# EAGLE design SparkFun_Main_Board_Single_v21 (EAGLE 9.4.2)
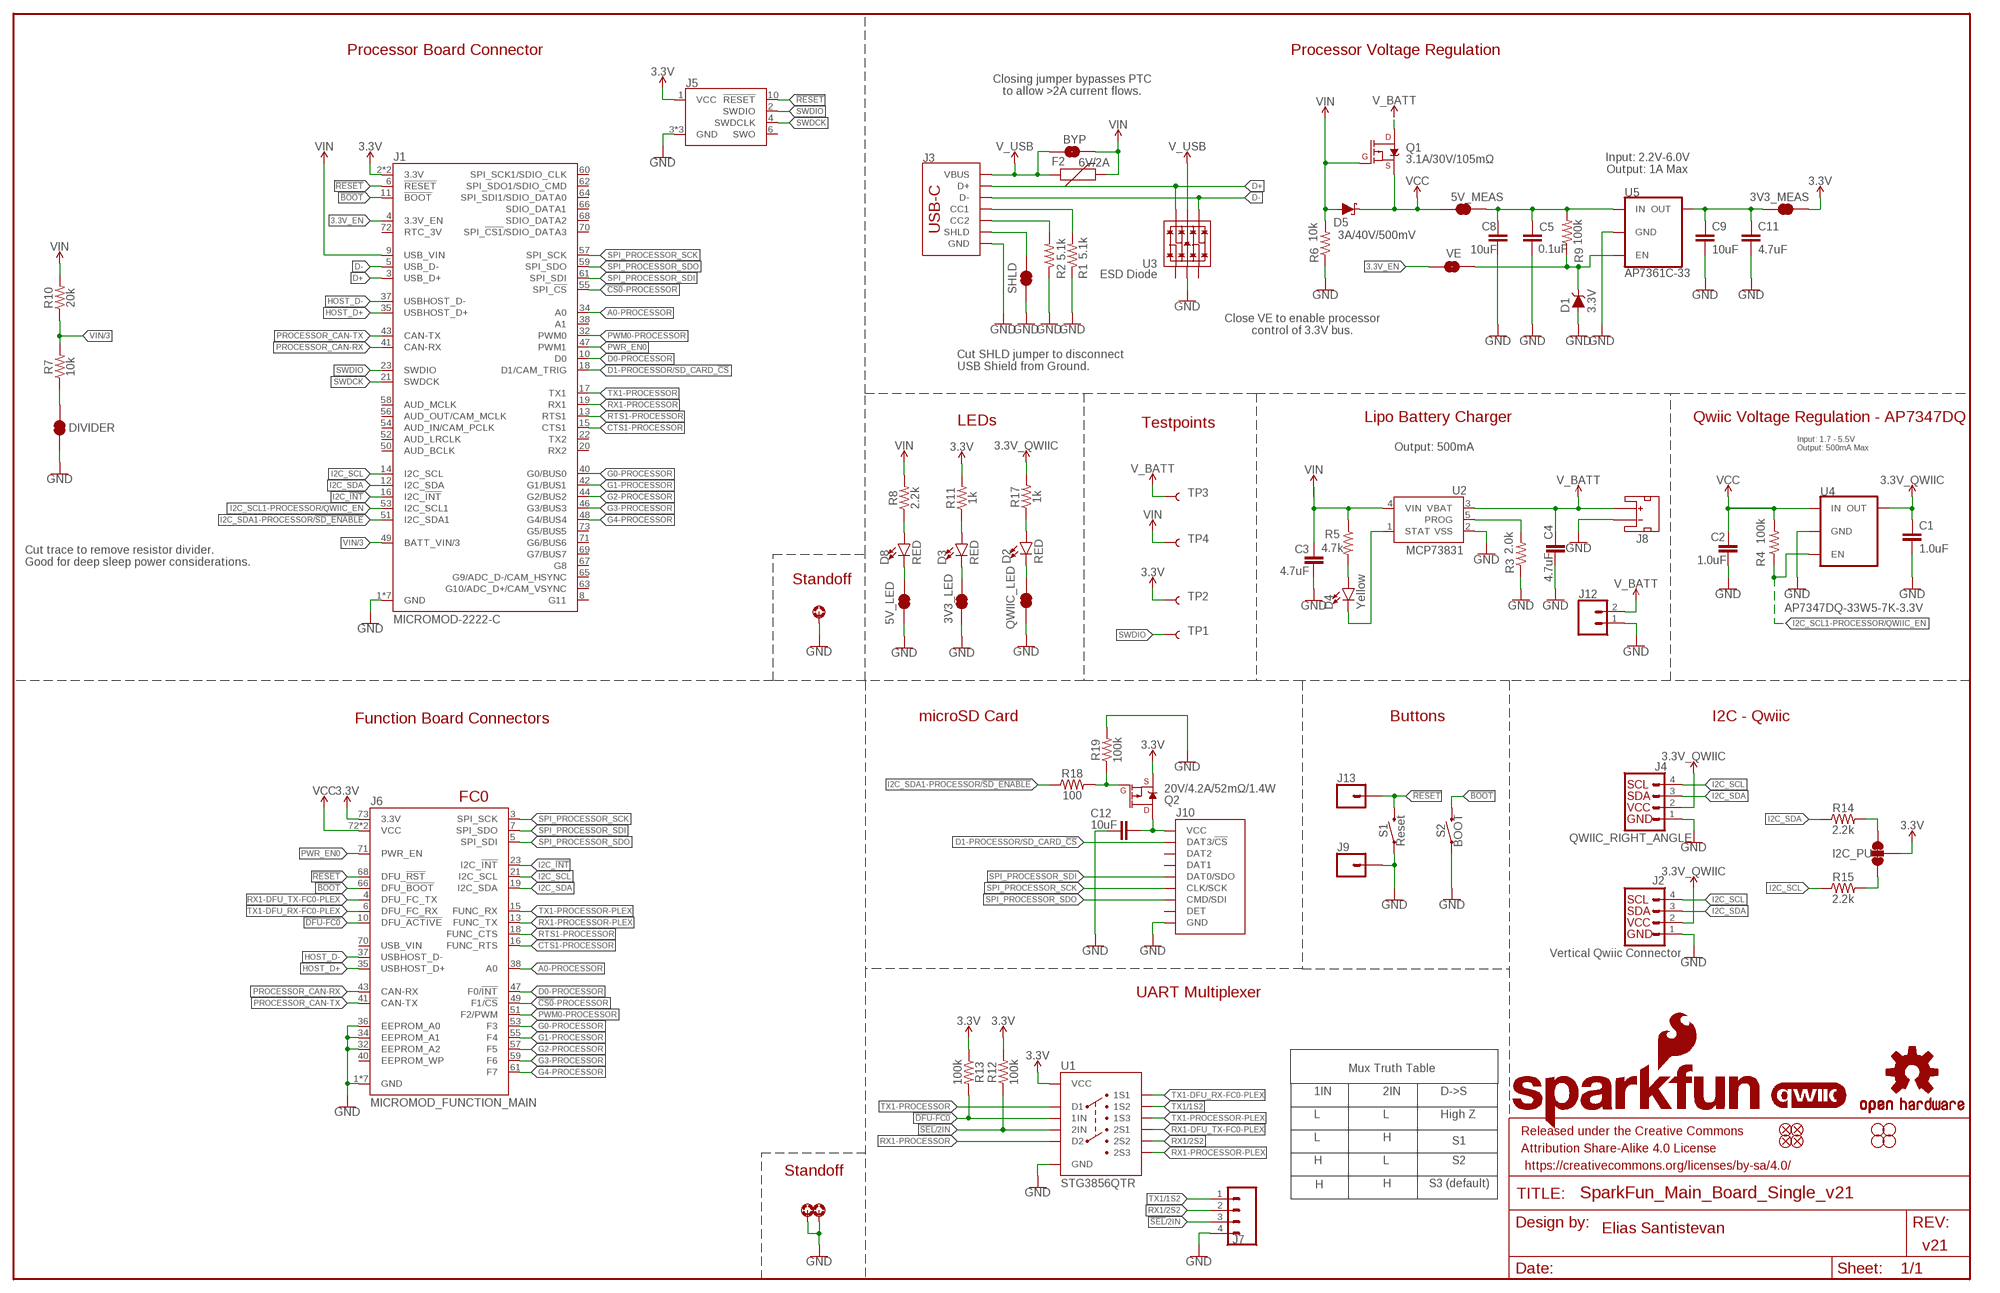
[diagram p0: schematic, sheet 1]

## Parts
3V3_LED  JUMPER-SMT_2_NC_TRACE_SILK  [SMT-JUMPER_2_NC_TRACE_SILK]
3V3_MEAS  JUMPER-COMBO_2_NC_TRACE  [COMBO-JUMPER_2_NC_TRACE]
5V_LED  JUMPER-SMT_2_NC_TRACE_SILK  [SMT-JUMPER_2_NC_TRACE_SILK]
5V_MEAS  JUMPER-COMBO_2_NC_TRACE  [COMBO-JUMPER_2_NC_TRACE]
BYP  JUMPER-SMT_2_NO_SILK  [SMT-JUMPER_2_NO_SILK]
C1  1.0uF  1.0UF-0603-16V-10%  [0603]
C2  1.0uF  1.0UF-0603-16V-10%  [0603]
C3  4.7uF  4.7UF-0603-6.3V-(10%)  [0603]
C4  4.7uF  4.7UF-0603-35V-(20%)  [0603]
C5  0.1uF  0.1UF-0603-25V-(+80/-20%)  [0603]
C8  10uF  10UF-0805-10V-10%  [0805]
C9  10uF  10UF-0603-6.3V-20%  [0603]
C11  4.7uF  4.7UF-0603-6.3V-(10%)  [0603]
C12  10uF  10UF-0603-6.3V-20%  [0603]
D1  3.3V  DIODE-ZENER-MM3Z3V3T1G  [SOD-323]
D2  RED  LED-RED0603  [LED-0603]
D3  RED  LED-RED0603  [LED-0603]
D4  Yellow  LED-YELLOW0603  [LED-0603]
D5  3A/40V/500mV  DIODE-SCHOTTKY-B340A  [SMA-DIODE]
D8  RED  LED-RED0603  [LED-0603]
DIVIDER  JUMPER-SMT_2_NC_TRACE_SILK  [SMT-JUMPER_2_NC_TRACE_SILK]
F2  6V/2A  PPTC_6V2A  [1210]
FD1  FIDUCIAL1X2  [FIDUCIAL-1X2]
FD2  FIDUCIAL1X2  [FIDUCIAL-1X2]
FD3  FIDUCIAL1X2  [FIDUCIAL-1X2]
FD4  FIDUCIAL1X2  [FIDUCIAL-1X2]
FRAME1  FRAME-LEDGER  [CREATIVE_COMMONS]
H2  STAND-OFF-REFLOW-M2.5_2.5MM_TALL  [STAND-OFF-REFLOW-M2.5]
H4  STAND-OFF-REFLOW-M2.5_2.5MM_TALL  [STAND-OFF-REFLOW-M2.5]
H8  STAND-OFF-REFLOW-M2.5_2.5MM_TALL  [STAND-OFF-REFLOW-M2.5]
H14  STAND-OFFTIGHT  [STAND-OFF-TIGHT]
H15  STAND-OFFTIGHT  [STAND-OFF-TIGHT]
H16  STAND-OFFTIGHT  [STAND-OFF-TIGHT]
H17  STAND-OFFTIGHT  [STAND-OFF-TIGHT]
I2C_PU  JUMPER-SMT_3_2-NC_TRACE_SILK  [SMT-JUMPER_3_2-NC_TRACE_SILK]
J1  MICROMOD-2222-C  [M.2-CONNECTOR-E]
J2  Vertical Qwiic Connector  QWIIC_CONNECTOR  [JST04_1MM_VERT]
J3  USB_C_2-LAYER_PADS  [USB-C-16P-2LAYER-PADS]
J4  QWIIC_RIGHT_ANGLE  QWIIC_CONNECTORJS-1MM  [JST04_1MM_RA]
J5  CORTEX_JTAG_DEBUG_MINIMUM_PTH  [2X5-PTH-1.27MM]
J6  MICROMOD_FUNCTION_MAIN  [M.2-CONNECTOR-E-FUNCTION-STANDARD]
J7  CONN_041X04_NO_SILK  [1X04_NO_SILK]
J8  JST_2MM_MALE  [JST-2-SMD]
J9  CONN_01PTH_NO_SILK_YES_STOP  [1X01_NO_SILK]
J10  MICRO-SD-PUSH-PUSH-EXT-PIN  [MICROSD-EXTERNALPIN]
J12  CONN_021X02_NO_SILK  [1X02_NO_SILK]
J13  CONN_01PTH_NO_SILK_YES_STOP  [1X01_NO_SILK]
LOGO1  QWIIC_LOGO_8MM  [QWIIC_8MM]
LOGO2  SFE_LOGO_NAME_FLAME.3_INCH  [SFE_LOGO_NAME_FLAME_.3]
LOGO3  OSHW-LOGOL  [OSHW-LOGO-L]
Q1  3.1A/30V/105mΩ  MOSFET_PCH-DMG2307L  [SOT23-3]
Q2  20V/4.2A/52mΩ/1.4W  MOSFET_PCH-DMG2305UX-7  [SOT23-3]
QWIIC_LED  JUMPER-SMT_2_NC_TRACE_SILK  [SMT-JUMPER_2_NC_TRACE_SILK]
R1  5.1k  5.1KOHM5.1KOHM-0603-1/10W-1%  [0603]
R2  5.1k  5.1KOHM5.1KOHM-0603-1/10W-1%  [0603]
R3  2.0k  2.0KOHM-0603-1/10W-5%  [0603]
R4  100k  100KOHM-0603-1/10W-1%  [0603]
R5  4.7k  4.7KOHM-0603-1/10W-1%  [0603]
R6  10k  10KOHM-0603-1/10W-1%  [0603]
R7  10k  10KOHM-0603-1/10W-1%  [0603]
R8  2.2k  2.2KOHM-0603-1/10W-1%  [0603]
R9  100k  100KOHM-0603-1/10W-1%  [0603]
R10  20k  20KOHM-0603-1/10W-1%  [0603]
R11  1k  1KOHM-0603-1/10W-1%  [0603]
R12  100k  100KOHM-0603-1/10W-1%  [0603]
R13  100k  100KOHM-0603-1/10W-1%  [0603]
R14  2.2k  2.2KOHM-0603-1/10W-1%  [0603]
R15  2.2k  2.2KOHM-0603-1/10W-1%  [0603]
R17  1k  1KOHM-0603-1/10W-1%  [0603]
R18  100  100OHM-0603-1/10W-1%  [0603]
R19  100k  100KOHM-0603-1/10W-1%  [0603]
S1  Reset  MOMENTARY-SWITCH-SPST-SMD-5.2-TALL-REDUNDANT  [TACTILE_SWITCH_SMD_5.2MM]
S2  BOOT  MOMENTARY-SWITCH-SPST-SMD-5.2-TALL-REDUNDANT  [TACTILE_SWITCH_SMD_5.2MM]
SHLD  JUMPER-SMT_2_NC_TRACE_SILK  [SMT-JUMPER_2_NC_TRACE_SILK]
TP1  TEST-POINT3X5  [PAD.03X.05]
TP2  TEST-POINT3X5  [PAD.03X.05]
TP3  TEST-POINT3X5  [PAD.03X.05]
TP4  TEST-POINT3X5  [PAD.03X.05]
U1  STG3856QTR  [STG3856]
U2  MCP73831  [SOT23-5]
U3  ESD Diode  TVS_DIODE_ARRAYSMD  [SOT-23-6]
U4  AP7347DQ-33W5-7K-3.3V  [SOT25]
U5  AP7361C-33  AP7361C-33FGEUDFN-8  [UDFN-8]
VE  JUMPER-SMT_2_NO_SILK  [SMT-JUMPER_2_NO_SILK]

## Nets
3.3V [POWER]: 3V3_MEAS.2 3V3_MEAS.4 I2C_PU.2 J1.2(3.3V) J1.74(3.3V) J5.1(VCC) J6.73(3.3V) Q2.2(S) R11.2 R12.2 R13.1 TP2.1 U1.P11(VCC)
3.3V_EN: J1.4(3.3V_EN) VE.1
3.3V_EN_VE: D1.C R9.1 U5.5(EN) VE.2
3.3V_QWIIC: C1.1 J2.2 J4.2 R17.2 U4.5(OUT)
3V3_MEAS: 3V3_MEAS.1 3V3_MEAS.3 C9.1 C11.1 U5.1(OUT)
!BOOT!: J1.11(!BOOT!) J6.66(DFU_!BOOT!) S2.3 S2.4
!CS0!-PROCESSOR: J1.55(SPI_!CS!) J6.49(F1/!CS!)
!DFU-FC0!: J6.10(DFU_!ACTIVE!) R13.2 U1.P12(1IN)
!RESET!: J1.6(!RESET!) J5.10(!RESET) J6.68(DFU_!RST!) J13.1 S1.3 S1.4
!SEL!/2IN: J7.3 R12.1 U1.P10(2IN)
A0-PROCESSOR: J1.34(A0) J6.38(A0)
CTS1-PROCESSOR: J1.15(CTS1) J6.16(FUNC_RTS)
D0-PROCESSOR: J1.10(D0) J6.47(F0/!INT!)
D1-PROCESSOR/SD_CARD_!CS!: J1.18(D1/CAM_TRIG) J10.2(DAT3/!CS!)
D+ [Diff pairs]: J1.3(USB_D+) J3.A6(D+) J3.B6(D+) U3.6(IO4)
D- [Diff pairs]: J1.5(USB_D-) J3.A7(D-) J3.B7(D-) U3.4(IO3)
G0-PROCESSOR: J1.40(G0/BUS0) J6.53(F3)
G1-PROCESSOR: J1.42(G1/BUS1) J6.55(F4)
G2-PROCESSOR: J1.44(G2/BUS2) J6.57(F5)
G3-PROCESSOR: J1.46(G3/BUS3) J6.59(F6)
G4-PROCESSOR: J1.48(G4/BUS4) J6.61(F7)
GND: 3V3_LED.1 5V_LED.1 C1.2 C2.2 C3.2 C4.2 C5.2 C8.2 C9.2 C11.2 C12.2 D1.A DIVIDER.1 H2.1 H4.1 H8.1 J1.1(GND) J1.7(GND) J1.33(GND) J1.36(GND) J1.39(GND) J1.45(GND) J1.75(GND) J2.1 J3.GND J3.GND2(GND) J4.1 J5.3(GND) J5.5(GND) J5.9(GND) J6.1(GND) J6.2(GND) J6.8(GND) J6.32(EEPROM_A2) J6.33(GND) J6.34(EEPROM_A1) J6.36(EEPROM_A0) J6.39(GND) J6.45(GND) J6.75(GND) J7.4 J8.1(-) J9.1 J10.6(GND) J10.10(GND) J10.11(GND) J10.12(GND) J10.13(GND) J12.1 QWIIC_LED.1 R1.1 R2.1 R3.1 R6.1 R19.2 S1.1 S1.2 S2.1 S2.2 SHLD.1 U1.P5(GND) U2.2(VSS) U3.2(VSS) U4.2(GND) U5.4(GND) U5.EP(GND)
HOST_D+ [Diff pairs]: J1.35(USBHOST_D+) J6.35(USBHOST_D+)
HOST_D- [Diff pairs]: J1.37(USBHOST_D-) J6.37(USBHOST_D-)
I2C_!INT!: J1.16(I2C_!INT!) J6.23(I2C_!INT!)
I2C_SCL: J1.14(I2C_SCL) J2.4 J4.4 J6.21(I2C_SCL) R15.1
I2C_SCL1-PROCESSOR/QWIIC_EN: J1.53(I2C_SCL1) R4.1 U4.3(EN)
I2C_SDA: J1.12(I2C_SDA) J2.3 J4.3 J6.19(I2C_SDA) R14.1
I2C_SDA1-PROCESSOR/!SD_ENABLE!: J1.51(I2C_SDA1) R18.1
N$2: 5V_LED.2 D8.C
N$3: D3.A R11.1
N$4: J3.B5(CC2) R2.2
N$5: J3.A5(CC1) R1.2
N$6: R3.2 U2.5(PROG)
N$7: DIVIDER.2 R7.1
N$8: D4.C U2.1(STAT)
N$9: D4.A R5.2
N$10: 3V3_LED.2 D3.C
N$11: I2C_PU.3 R14.2
N$12: D8.A R8.1
N$13: I2C_PU.1 R15.2
N$14: D2.A R17.1
N$15: D2.C QWIIC_LED.2
N$16 [POWER]: C12.1 J10.4(VCC) Q2.3(D)
N$18: Q2.1(G) R18.2 R19.1
PROCESSOR_CAN-RX: J1.41(CAN-RX) J6.43(CAN-RX)
PROCESSOR_CAN-TX: J1.43(CAN-TX) J6.41(CAN-TX)
PWM0-PROCESSOR: J1.32(PWM0) J6.51(F2/PWM)
PWR_EN0: J1.47(PWM1) J6.71(PWR_EN)
RTS1-PROCESSOR: J1.13(RTS1) J6.18(FUNC_CTS)
RX1-DFU_TX-FC0-PLEX: J6.4(DFU_FC_TX) U1.P9(2S1)
RX1-PROCESSOR: J1.19(RX1) U1.P6(D2)
RX1-PROCESSOR-PLEX: J6.13(FUNC_TX) U1.P7(2S3)
RX1/2S2: J7.2 U1.P8(2S2)
SHLD: J3.SHLD1(SHLD) J3.SHLD2(SHLD) J3.SHLD3(SHLD) J3.SHLD4(SHLD) SHLD.2
SPI_PROCESSOR_SCK: J1.57(SPI_SCK) J6.3(SPI_SCK) J10.5(CLK/SCK)
SPI_PROCESSOR_SDI: J1.61(SPI_SDI) J6.7(SPI_SDO) J10.7(DAT0/SDO)
SPI_PROCESSOR_SDO: J1.59(SPI_SDO) J6.5(SPI_SDI) J10.3(CMD/SDI)
SWDCK: J1.21(SWDCK) J5.4(SWDCLK)
SWDIO: J1.23(SWDIO) J5.2(SWDIO) TP1.1
TX1-DFU_RX-FC0-PLEX: J6.6(DFU_FC_RX) U1.P1(1S1)
TX1-PROCESSOR: J1.17(TX1) U1.P4(D1)
TX1-PROCESSOR-PLEX: J6.15(FUNC_RX) U1.P3(1S3)
TX1/1S2: J7.1 U1.P2(1S2)
V_BATT [POWER]: C4.1 J8.2(+) J12.2 Q1.3(D) TP3.1 U2.3(VBAT)
V_USB: BYP.1 F2.1 J3.VBUS1(VBUS) J3.VBUS2(VBUS) U3.5(VCC)
VCC: 5V_MEAS.1 5V_MEAS.3 C2.1 D5.C J6.72(VCC) J6.74(VCC) Q1.2(S) R4.2 U4.1(IN)
VCC_MEAS: 5V_MEAS.2 5V_MEAS.4 C5.1 C8.1 R9.2 U5.8(IN)
VIN: BYP.2 C3.1 D5.A F2.2 J1.9(USB_VIN) Q1.1(G) R5.1 R6.2 R8.2 R10.2 TP4.1 U2.4(VIN)
VIN/3: J1.49(BATT_VIN/3) R7.2 R10.1
Unconnected: J1.8(G11) J1.20(RX2) J1.22(TX2) J1.38(A1) J1.50(AUD_BCLK) J1.52(AUD_LRCLK) J1.54(AUD_IN/CAM_PCLK) J1.56(AUD_OUT/CAM_MCLK) J1.58(AUD_MCLK) J1.60(SPI_SCK1/SDIO_CLK) J1.62(SPI_SDO1/SDIO_CMD) J1.63(G10/ADC_D+/CAM_VSYNC) J1.64(SPI_SDI1/SDIO_DATA0) J1.65(G9/ADC_D-/CAM_HSYNC) J1.66(SDIO_DATA1) J1.67(G8) J1.68(SDIO_DATA2) J1.69(G7/BUS7) J1.70(SPI_!CS1!/SDIO_DATA3) J1.71(G6/BUS6) J1.72(RTC_3V) J1.73(G5/BUS5) J5.6(SWO) J6.40(EEPROM_WP) J6.70(USB_VIN) J8.NC1(PAD1) J8.NC2(PAD2) J10.1(DAT2) J10.8(DAT1) J10.9(DET) U3.1(IO1) U3.3(IO2)

## Notes on the sheet
- Processor Board Connector | Processor Voltage Regulation
- Closing jumper bypasses PTC
  to allow >2A current flows.
- Input: 2.2V-6.0V
  Output: 1A Max
- Close VE to enable processor
  control of 3.3V bus.
- Cut SHLD jumper to disconnect
  USB Shield from Ground.
- Lipo Battery Charger | Qwiic Voltage Regulation - AP7347DQ
- LEDs | Testpoints
- Output: 500mA
- Input: 1.7 - 5.5V
  Output: 500mA Max
- Cut trace to remove resistor divider.
  Good for deep sleep power considerations.
- Standoff
- Function Board Connectors | microSD Card | Buttons | I2C - Qwiic
- FC0
- UART Multiplexer
- Mux Truth Table
- 1IN | 2IN | D->S
- L | L | High Z
- L | H
- S1
- H | L | S2
- Standoff
- H | H | S3 (default)
- Elias Santistevan
- v21

## Library data of the parts
3V3_LED 5V_LED DIVIDER QWIIC_LED SHLD = SparkFun-Jumpers:JUMPER-SMT_2_NC_TRACE: Normally closed trace jumper This jumper has a trace between two pads so it's normally closed (NC). Use a razor knife to open the connection. For best results follow the IPC guidelines for cutting traces: Cutout at least 0.063 mm (0.005 in). Remove all loose material to clean up the cut area. Seal the cut with an approved epoxy. Reapply solder to reclose the connection.
3V3_MEAS 5V_MEAS = SparkFun-Jumpers:JUMPER-COMBO_2_NC_TRACE
BYP VE = SparkFun-Jumpers:JUMPER-SMT_2_NO: Normally open jumper This jumper has two pads in close proximity to each other. Apply solder to close the connection. Round pads are easier to solder for beginners, but are a lot larger. SparkFun Product that uses the round pads: SparkFun EL Sequencer <https://www.sparkfun.com/products/12781>
C1 C2 = SparkFun-Capacitors:1.0UF: 1µF ceramic capacitors A capacitor is a passive two-terminal electrical component used to store electrical energy temporarily in an electric field.; PROD_ID: CAP-00868
C3 C11 = SparkFun-Capacitors:4.7UF: 4.7µF ceramic capacitors A capacitor is a passive two-terminal electrical component used to store electrical energy temporarily in an electric field.; PROD_ID: CAP-08280
C4 = SparkFun-Capacitors:4.7UF: 4.7µF ceramic capacitors A capacitor is a passive two-terminal electrical component used to store electrical energy temporarily in an electric field.; PROD_ID: CAP-14106
C5 = SparkFun-Capacitors:0.1UF: 0.1µF ceramic capacitors A capacitor is a passive two-terminal electrical component used to store electrical energy temporarily in an electric field.; PROD_ID: CAP-00810
C8 = SparkFun-Capacitors:10UF: 10.0µF ceramic capacitors A capacitor is a passive two-terminal electrical component used to store electrical energy temporarily in an electric field.; PROD_ID: CAP-11330
C9 C12 = SparkFun-Capacitors:10UF: 10.0µF ceramic capacitors A capacitor is a passive two-terminal electrical component used to store electrical energy temporarily in an electric field.; PROD_ID: CAP-11015
D1 = SparkFun-DiscreteSemi:DIODE-ZENER: Zener Diode A Zener diode allows current to flow from its anode to its cathode like a normal semiconductor diode, but it also permits current to flow in the reverse direction when its "Zener voltage" is reached. - WIkipedia; PROD_ID: DIO-11284
D2 D3 D8 = SparkFun-LED:LED-RED: Red SMD LED Used in manufacturing of most products at SparkFun Packages: 0603 - SMD 0603 package [Product Link] <http://docs.avagotech.com/docs/AV02-0551EN> 0603 SMART - SMD 0603 SMART package ( more efficient and expensive)[Product Link] <http://www.osram-os.com/Graphics/XPic2/00077099_0.pdf> 1206 - SMD1206 package [Product Link] <https://www.sparkfun.com/datasheets/DevTools/LilyPad/Q150OVS4.pdff> SparkFun Products: Pro Mini 328 -5V <https://www.sparkfun.com/products/821> RedBoard <https://www.sparkfun.com/products/12757> IOIO-OTG <https://www.sparkfun.com/products/13613>; PROD_ID: DIO-00819
D4 = SparkFun-LED:LED-YELLOW: Yellow SMD LED Used in manufacturing several products at SparkFun. Packages: 0603 - SMD 0603 package[Product Link] <http://www.kingbrightusa.com/product.asp?catalog_name=LED&product_id=APT1608SYCK> 0603 -SMART - SMART SMD 0603 package (more efficient/more expensive) [Product Link] <http://www.osram-os.com/osram_os/en/products/product-catalog/led-light-emitting-diodes/smartled-0603/ly-l29k/index.jsp> LilyPad - SMD1206 package[Product Datasheet] <https://www.sparkfun.com/datasheets/DevTools/LilyPad/Q150YUS4.pdf> SparkFun Products: Blynk Board <https://www.sparkfun.com/products/13794> IOIO-OTG <https://www.sparkfun.com/products/13613> XBee Explorer Serial <https://www.sparkfun.com/products/13225>; PROD_ID: DIO-09003
D5 = SparkFun-DiscreteSemi:DIODE-SCHOTTKY: Schottky diode A Schottky diode is a semiconductor diode which has a low forward voltage drop and a very fast switching action.; PROD_ID: DIO-09886
F2 = SparkFun-Fuses:PPTC: Resettable Fuse PPTC Resettable Fuse. Really a sort of resistor with a polymeric positive temperature coefficient whose resistance increases dramatically with an increase in temperature. When heated by the power passing through the resistance rises causing the current to be limited, protecting the circuit. This is achieved by the transition of the polymer from a crystalline to an amorphous state where the conductive carbon separates breaking the conductive pathways found in the cool crystalline structure. When a PPTC cools back down it resumes conducting letting the circuit turn back on. SparkFun Products: SparkFun RedBoard - Programmed with Arduino <https://www.sparkfun.com/products/12757> Pro Micro - 5V/16MHz <https://www.sparkfun.com/products/12640> Arduino Pro 328 - 5V/16MHz <https://www.sparkfun.com/products/10915> MP3 Trigger <https://www.sparkfun.com/products/13720>; PROD_ID: RES-14313
FD1-FD4 = SparkFun-Aesthetics:FIDUCIAL: Fiducial Alignment Points Point-of-reference for pick-and-place machines and other optical instruments.
FRAME1 = SparkFun-Aesthetics:FRAME-LEDGER: Schematic Frame - Ledger Standard 11x14 US Ledger frame
H2 H4 H8 = SparkFun-Hardware:STAND-OFF-REFLOW: Stand Off Reflow Compatible A metal standoff that can be placed and reflowed onto a PCB. The M2.5 x 2.5mm variant is used on MicroMod. The M2.5 x 1.5mm variant is used to hold mPCIe boards, including the Swarm M138. The M2.0 x 6.0mm variant is used to mount the Iridium 9603N modem.; PROD_ID: HW-14899
H14-H17 = SparkFun-Hardware:STAND-OFF: Stand Off Drill holes for mechanically mounting via screws, standoffs, etc. Note: Use the keepout ring to avoid running the screw head into surrounding components. Variant Overviews STAND-OFF - Mechanical footprint for a #4 phillips button head screw. STAND-OFF-TIGHT - Mechanical footprint for a #4 phillips button head screw, Example SparkFun Products Screw - Phillips Head (1/4", 4-40, 10 pack) <https://www.sparkfun.com/products/10453> (PRT-10453) Screw - Phillips Head (1/2", 4-40, 10 pack) <https://www.sparkfun.com/products/10452> (PRT-10452) Screw - Phillips Head (3/4", 4-40, 10 pack) <https://www.sparkfun.com/products/10451> (PRT-10451) Screw - Phillips Head (1", 4-40, 10 pack) <https://www.sparkfun.com/products/10450> (PRT-10450)
I2C_PU = SparkFun-Jumpers:JUMPER-SMT_3_2-NC_TRACE: Normally closed trace jumper (2 of 2 connections) This jumper has a trace between all three pads so they are normally closed (NC). Use a razor knife to open the connection(s). For best results follow the IPC guidelines for cutting traces: Cutout at least 0.063 mm (0.005 in). Remove all loose material to clean up the cut area. Seal the cut with an approved epoxy. Reapply solder to reclose the connection(s).
J1 = SparkFun-MicroMod:MICROMOD: MicroMod Connector Description: A card edge connector and mating PCB connector to allow various MicroMod Processor Boards to be coupled with various carrier boards of different capabilities. Based on the M.2 standard.; PROD_ID: CONN-14877
J2 = SparkFun-Connectors:QWIIC_CONNECTOR: SparkFun I2C Standard Qwiic Connector An SMD 1mm pitch JST connector makes it easy and quick (get it? Qwiic?) to connect I2C devices to each other. The Qwiic system <http://www.sparkfun.com/qwiic> enables fast and solderless connection between popular platforms and various sensors and actuators. We carry 200mm <https://www.sparkfun.com/products/14204>, 100mm <https://www.sparkfun.com/products/14205>, 50mm <https://www.sparkfun.com/products/14206>, and breadboard friendly <https://www.sparkfun.com/products/14207> Qwiic cables. We also offer 10 pcs strips <https://www.sparkfun.com/products/14323> the SMD connectors.; PROD_ID: CONN-14483
J3 = SparkFun-Connectors:USB_C: USB Type C 16Pin Connector Super Speed pins not available on the 16-pin purely SMD connector so this part is best for USB 2.0 implementations. D1 and D2 are tied together enabling D+/- no matter which way the cable is plugged into the connector. The two channel configuration pins (CC1/2) are exposed. These are normally connected to ground via 5.1k resistors but can be reconfigured for high current/high power applications. **4-LAYER BOARD WARNING!!** If designing 4-layer board, make sure to select the variant _4-LAYER-ISOLATED. The linked footprint (USB-C-16-4LAYER-ISOLATED) includes some very necessary cutout polygons in the inner layers (2 and 15). This prevents the PTH mounting shield legs on the USB connector from electrically connecting any other polygons on the inner layers (usually VCC and GND).; PROD_ID: CONN-14122
J4 = SparkFun-Connectors:QWIIC_CONNECTOR: SparkFun I2C Standard Qwiic Connector An SMD 1mm pitch JST connector makes it easy and quick (get it? Qwiic?) to connect I2C devices to each other. The Qwiic system <http://www.sparkfun.com/qwiic> enables fast and solderless connection between popular platforms and various sensors and actuators. We carry 200mm <https://www.sparkfun.com/products/14204>, 100mm <https://www.sparkfun.com/products/14205>, 50mm <https://www.sparkfun.com/products/14206>, and breadboard friendly <https://www.sparkfun.com/products/14207> Qwiic cables. We also offer 10 pcs strips <https://www.sparkfun.com/products/14323> the SMD connectors.; PROD_ID: CONN-13694
J5 = SparkFun-Connectors:CORTEX_JTAG_DEBUG_MINIMUM: Cortex Debug Connector - 10 pin Supports JTAG debug, Serial Wire debug, and Serial Wire Viewer. PTH and SMD connector options available. General Connector Information <http://infocenter.arm.com/help/topic/com.arm.doc.faqs/attached/13634/cortex_debug_connectors.pdf> Products: PTH Connector <http://www.digikey.com/product-detail/en/cnc-tech/3220-10-0100-00/1175-1627-ND/3883661> -via Digi-Key SparkFun PSoc <https://www.sparkfun.com/products/13229> SparkFun T <https://www.sparkfun.com/products/13810>
J6 = SparkFun-MicroMod:MICROMOD_FUNCTION: MicroMod Connector Description: A card edge connector and mating PCB connector to allow various MicroMod Processor Boards to be coupled with various carrier boards of different capabilities. Based on the M.2 standard.; PROD_ID: CONN-14877
J7 = SparkFun-Connectors:CONN_04: Multi connection point. Often used as Generic Header-pin footprint for 0.1 inch spaced/style header connections On any of the 0.1 inch spaced packages, you can populate with these: Break Away Headers - Straight <https://www.sparkfun.com/products/116> (PRT-00116) Break Away Male Headers - Right Angle <https://www.sparkfun.com/products/553> (PRT-00553) Female Headers <https://www.sparkfun.com/products/115> (PRT-00115) Break Away Headers - Machine Pin <https://www.sparkfun.com/products/117> (PRT-00117) Break Away Female Headers - Swiss Machine Pin <https://www.sparkfun.com/products/743> (PRT-00743) For SCREWTERMINALS and SPRING TERMINALS visit here: Screw Terimnals on SparkFun.com <https://www.sparkfun.com/search/results?term=Screw+Terminals> (5mm/3.5mm/2.54mm spacing) This device is also useful as a general connection point to wire up your design to another part of your project. Our various solder wires solder well into these plated through hole pads. Hook-Up Wire - Assortment (Stranded, 22 AWG) <https://www.sparkfun.com/products/11375> (PRT-11375) Hook-Up Wire - Assortment (Solid Core, 22 AWG) <https://www.sparkfun.com/products/11367> (PRT-11367) View the entire wire category on our website here <https://www.sparkfun.com/categories/141> Special notes: Molex polarized connector foot print use with SKU : PRT-08231 with associated crimp pins and housings. 1MM SMD Version SKU: PRT-10208; PROD_ID: CONN-09696
J8 = SparkFun-Connectors:JST_2MM_MALE: JST 2MM MALE RA CONNECTOR Two pin, compact surface mount connector. Commonly used as a battery input connection point. We really like the solid locking feeling and high current rating on these small connectors. We use these all the time as battery connectors. Mates to single-cell LiPo batteries. Here is the connector we sell at SparkFun: JST Right Angle Connector - White <https://www.sparkfun.com/products/8612> (PRT-08612) Datasheet <http://www.sparkfun.com/datasheets/Prototyping/Connectors/JST-Horizontal.pdf> It was used on these SparkFun products: SparkFun MOSFET Power Controller <https://www.sparkfun.com/products/11214> (PRT-11214) SparkFun Battery Babysitter - LiPo Battery Manager <https://www.sparkfun.com/products/13777> (PRT-13777) And many, many others that required a lipo battery connection.; PROD_ID: CONN-11443; SF_ID: PRT-08612
J9 J13 = SparkFun-Connectors:CONN_01: Single connection point. Often used as Generic Header-pin footprint for 0.1 inch spaced/style header connections On any of the 0.1 inch spaced packages, you can populate with these: Break Away Headers - Straight <https://www.sparkfun.com/products/116> (PRT-00116) Break Away Male Headers - Right Angle <https://www.sparkfun.com/products/553> (PRT-00553) Female Headers <https://www.sparkfun.com/products/115> (PRT-00115) Break Away Headers - Machine Pin <https://www.sparkfun.com/products/117> (PRT-00117) Break Away Female Headers - Swiss Machine Pin <https://www.sparkfun.com/products/743> (PRT-00743) This device is also useful as a general connection point to wire up your design to another part of your project. Our various solder wires solder well into these plated through hole pads. Hook-Up Wire - Assortment (Stranded, 22 AWG) <https://www.sparkfun.com/products/11375> (PRT-11375) Hook-Up Wire - Assortment (Solid Core, 22 AWG) <https://www.sparkfun.com/products/11367> (PRT-11367) View the entire wire category on our website here <https://www.sparkfun.com/categories/141> Special notes: SMTSO-256-ET is a "flush mount" nut for a 4-40 screw. We mostly use this on specialty testbeds; it is a nice way to connect hardware to your PCB at an adjustable hieght. Also note, the SNAP packages are for using a snappable style connector. We sell a baggie of snaps and they are also used on two LilyPad designs: Snap Assortment - 30 pack (male and female) <https://www.sparkfun.com/products/11347> (DEV-11347) LilyPad Arduino SimpleSnap <https://www.sparkfun.com/products/10941> (DEV-10941) LilyPad SimpleSnap Protoboard <https://www.sparkfun.com/products/10940> (DEV-10940)
J10 = SparkFun-Connectors:MICRO-SD: microSD Socket for Transflash Various sockets for µSD. tDoc lines correctly indicate media card edge positions when inserting (unlocked, locked, depressed). NOTE: CD1 and CD2 are connected internally, and the default detect state of the socket is detect pin to ground. SparkFun Products: WAV Trigger <https://www.sparkfun.com/products/13660> CAN-Bus Shield <https://www.sparkfun.com/products/13262> SparkFun Level Shifing microSD Breakout <https://www.sparkfun.com/products/13743>; PROD_ID: CONN-16110
J12 = SparkFun-Connectors:CONN_02: Multi connection point. Often used as Generic Header-pin footprint for 0.1 inch spaced/style header connections On any of the 0.1 inch spaced packages, you can populate with these: Break Away Headers - Straight <https://www.sparkfun.com/products/116> (PRT-00116) Break Away Male Headers - Right Angle <https://www.sparkfun.com/products/553> (PRT-00553) Female Headers <https://www.sparkfun.com/products/115> (PRT-00115) Break Away Headers - Machine Pin <https://www.sparkfun.com/products/117> (PRT-00117) Break Away Female Headers - Swiss Machine Pin <https://www.sparkfun.com/products/743> (PRT-00743) For SCREWTERMINALS and SPRING TERMINALS visit here: Screw Terimnals on SparkFun.com <https://www.sparkfun.com/search/results?term=Screw+Terminals> (5mm/3.5mm/2.54mm spacing) This device is also useful as a general connection point to wire up your design to another part of your project. Our various solder wires solder well into these plated through hole pads. Hook-Up Wire - Assortment (Stranded, 22 AWG) <https://www.sparkfun.com/products/11375> (PRT-11375) Hook-Up Wire - Assortment (Solid Core, 22 AWG) <https://www.sparkfun.com/products/11367> (PRT-11367) View the entire wire category on our website here <https://www.sparkfun.com/categories/141> Special notes: Molex polarized connector foot print use with: PRT-08233 with associated crimp pins and housings. 2.54_SCREWTERM for use with PRT-10571. 3.5mm Screw Terminal footprints for PRT-08084 5mm Screw Terminal footprints for use with PRT-08432
LOGO1 = SparkFun-Aesthetics:QWIIC_LOGO: Qwiic Logos for placement on schematic and PCB. The 5.5mm silk logo is best for placing next to Qwiic connector.
LOGO2 = SparkFun-Aesthetics:SFE_LOGO_NAME_FLAME: SparkFun Font Logo w/ Flame This is the SparkFun full logo. The logo on the schematic will always be the same size; the package variant is the height of the flame part of the logo. Default layer for the logo on the board is tSilk.
LOGO3 = SparkFun-Aesthetics:OSHW-LOGO: Open-Source Hardware (OSHW) Logo This logo indicates the piece of hardware it is found on incorporates a OSHW license and/or adheres to the definition of open source hardware found here: http://freedomdefined.org/OSHW
Q1 = SparkFun-DiscreteSemi:MOSFET_PCH: P-channel MOSFETs Voltage controlled devices that allow control of high current outputs. SparkFun Products: SparkFun ESP32 Thing <https://www.sparkfun.com/products/13907> SparkFun ESP8266 Thing <https://www.sparkfun.com/products/13231> SparkFun Pi Servo HAT V2 <https://www.sparkfun.com/products/15316> DMG2305UX-7 (20V/4.2A/SOT23-3); PROD_ID: TRANS-11308
Q2 = SparkFun-DiscreteSemi:MOSFET_PCH: P-channel MOSFETs Voltage controlled devices that allow control of high current outputs. SparkFun Products: SparkFun ESP32 Thing <https://www.sparkfun.com/products/13907> SparkFun ESP8266 Thing <https://www.sparkfun.com/products/13231> SparkFun Pi Servo HAT V2 <https://www.sparkfun.com/products/15316> DMG2305UX-7 (20V/4.2A/SOT23-3); PROD_ID: TRANS-14388
R1 R2 = SparkFun-Resistors:5.1KOHM; PROD_ID: RES-12083
R3 = SparkFun-Resistors:2.0KOHM: 2kΩ resistor A resistor is a passive two-terminal electrical component that implements electrical resistance as a circuit element. Resistors act to reduce current flow, and, at the same time, act to lower voltage levels within circuits. - Wikipedia; PROD_ID: RES-08296
R4 R9 R12 R13 R19 = SparkFun-Resistors:100KOHM: 100kΩ resistor A resistor is a passive two-terminal electrical component that implements electrical resistance as a circuit element. Resistors act to reduce current flow, and, at the same time, act to lower voltage levels within circuits. - Wikipedia; PROD_ID: RES-07828
R5 = SparkFun-Resistors:4.7KOHM: 4.7kΩ resistor A resistor is a passive two-terminal electrical component that implements electrical resistance as a circuit element. Resistors act to reduce current flow, and, at the same time, act to lower voltage levels within circuits. - Wikipedia; PROD_ID: RES-07857
R6 R7 = SparkFun-Resistors:10KOHM: 10kΩ resistor A resistor is a passive two-terminal electrical component that implements electrical resistance as a circuit element. Resistors act to reduce current flow, and, at the same time, act to lower voltage levels within circuits. - Wikipedia; PROD_ID: RES-00824
R8 R14 R15 = SparkFun-Resistors:2.2KOHM: 2.2kΩ resistor A resistor is a passive two-terminal electrical component that implements electrical resistance as a circuit element. Resistors act to reduce current flow, and, at the same time, act to lower voltage levels within circuits. - Wikipedia; PROD_ID: RES-08272
R10 = SparkFun-Resistors:20KOHM: 20kΩ resistor A resistor is a passive two-terminal electrical component that implements electrical resistance as a circuit element. Resistors act to reduce current flow, and, at the same time, act to lower voltage levels within circuits. - Wikipedia; PROD_ID: RES-09383
R11 R17 = SparkFun-Resistors:1KOHM: 1kΩ resistor A resistor is a passive two-terminal electrical component that implements electrical resistance as a circuit element. Resistors act to reduce current flow, and, at the same time, act to lower voltage levels within circuits. - Wikipedia; PROD_ID: RES-07856
R18 = SparkFun-Resistors:100OHM: 100Ω resistor A resistor is a passive two-terminal electrical component that implements electrical resistance as a circuit element. Resistors act to reduce current flow, and, at the same time, act to lower voltage levels within circuits. - Wikipedia; PROD_ID: RES-07863
S1 S2 = SparkFun-Switches:MOMENTARY-SWITCH-SPST: Momentary Switch (Pushbutton) - SPST Normally-open (NO) SPST momentary switches (buttons, pushbuttons). Variants PTH-12MM - 12mm square, through-hole Momentary Pushbutton Switch - 12mm Square <https://www.sparkfun.com/products/9190> (COM-09190) PTH-6.0MM, PTH-6.0MM-KIT - 6.0mm square, through-hole Mini Pushbutton Switch <https://www.sparkfun.com/products/97> (COM-00097) KIT package intended for soldering kit's - only one side of pads' copper is exposed. PTH-RIGHT-ANGLE-KIT - Right-angle, through-hole Right Angle Tactile Button <https://www.sparkfun.com/products/10791> - Used on SparkFun BigTime Watch Kit <https://www.sparkfun.com/products/11734> SMD-12MM - 12mm square, surface-mount Tactile Button - SMD (12mm) <https://www.sparkfun.com/products/12993> (COM-12993) Used on SparkFun PicoBoard <https://www.sparkfun.com/products/11888> SMD-4.5MM - 4.5mm Square Trackball Switch Used on SparkFun Blackberry Trackballer Breakout <https://www.sparkfun.com/products/13169> SMD-4.6MMX2.8MM - 4.60mm x 2.80mm, surface mount Used on SparkFun Pro Micro - RP2040 <https://www.sparkfun.com/products/17717> SMD-5.2MM, SMD-5.2-REDUNDANT - 5.2mm square, surface-mount Mini Pushbutton Switch - SMD <https://www.sparkfun.com/products/8720> (COM-08720) Used on Arduino Pro Mini <https://www.sparkfun.com/products/11114> REDUNDANT package connects both switch circuits together SMD-6.0X3.5MM - 6.0 x 3.5mm, surface mount Momentary Reset Switch SMD <https://www.sparkfun.com/products/8229> (COM-08229) SMD-6.2MM-TALL - 6.2mm square, surface mount Tactile Button - SMD (6mm) <https://www.sparkfun.com/products/12992> Used on SparkFun Digital Sandbox <https://www.sparkfun.com/products/12651> SMD-RIGHT-ANGLE - Right-angle, surface mount Used on SparkFun Block for Intel® Edison - Arduino <https://www.sparkfun.com/products/13036>; PROD_ID: SWCH-14139
TP1-TP4 = SparkFun-Connectors:TEST-POINT: SparkFun Test Points Bare copper test points for troubleshooting or In-Circuit-Testing. These are used by our Production team for verifying production board runs using pogo-pins on test beds. SparkFun Products: SparkFun LSM9DS1 Breakout <https://www.sparkfun.com/products/13284> SparkFun PSOC <https://www.sparkfun.com/products/13714> SparkFun Load Cell Amplifier <https://www.sparkfun.com/products/13879>
U1 = dip_switch:STG3856QTR; PROD_ID: IC-17058
U2 = SparkFun-IC-Power:MCP73831: MCP73831T Li-Ion, Li-Pol Controller Miniature single cell, fully integrated Li-Ion, Li-polymer charge management controller Datasheet <http://ww1.microchip.com/downloads/en/DeviceDoc/20001984g.pdf> SparkFun Products: SparkFun ESP32 Thing <https://www.sparkfun.com/products/13907> SparkFun 9DoF Razor IMU M0 <https://www.sparkfun.com/products/14001>; PROD_ID: IC-09995
U3 = SparkFun-DiscreteSemi:TVS_DIODE_ARRAY; PROD_ID: IC-13538
U4 = dip_switch:AP7347DQ-33W5-7: AP7347DQ - 500mA CMOS LDO Regulator w/ Enable The AP2112 is CMOS process low dropout linear regulator with enable function, the regulator delivers a guaranteed 600mA (min.) continuous load current. Features Output Voltage Accuracy: ±1% Output Current: 500mA Foldback Short Current Protection: 180mA Enable Function to Turn ON/OFF VOUT Low Dropout Voltage (3.3V): 270mV (Typ.) @IOUT=500mA Excellent Load Regulation: 22.5mV Excellent Line Regulation: 0.02%/V (Typ.) Low Quiescent Current: 60μA (Typ.) Low Standby Current: 0.01μA (Typ.) Low Output Noise: 60μVRMS PSRR: 100Hz -65dB, 1kHz -65dB OTSD Protection Stable with 1.0μF Flexible Cap: Ceramic, Tantalum and Aluminum Electrolytic Operation Temperature Range: -40°C to 85°C ESD: MM 400V, HBM 4000V; PROD_ID: VREG-17101
U5 = SparkFun-IC-Power:AP7361C-33FGE: AP7361C 3.3V LDO Regulator; PROD_ID: VREG-14094

## Net classes
0 default: width 0.178 mm, drill 0.305 mm
1 POWER: width 0.559 mm, drill 0.305 mm
2 Diff pairs: width 0.203 mm, drill 0.305 mm

## Board
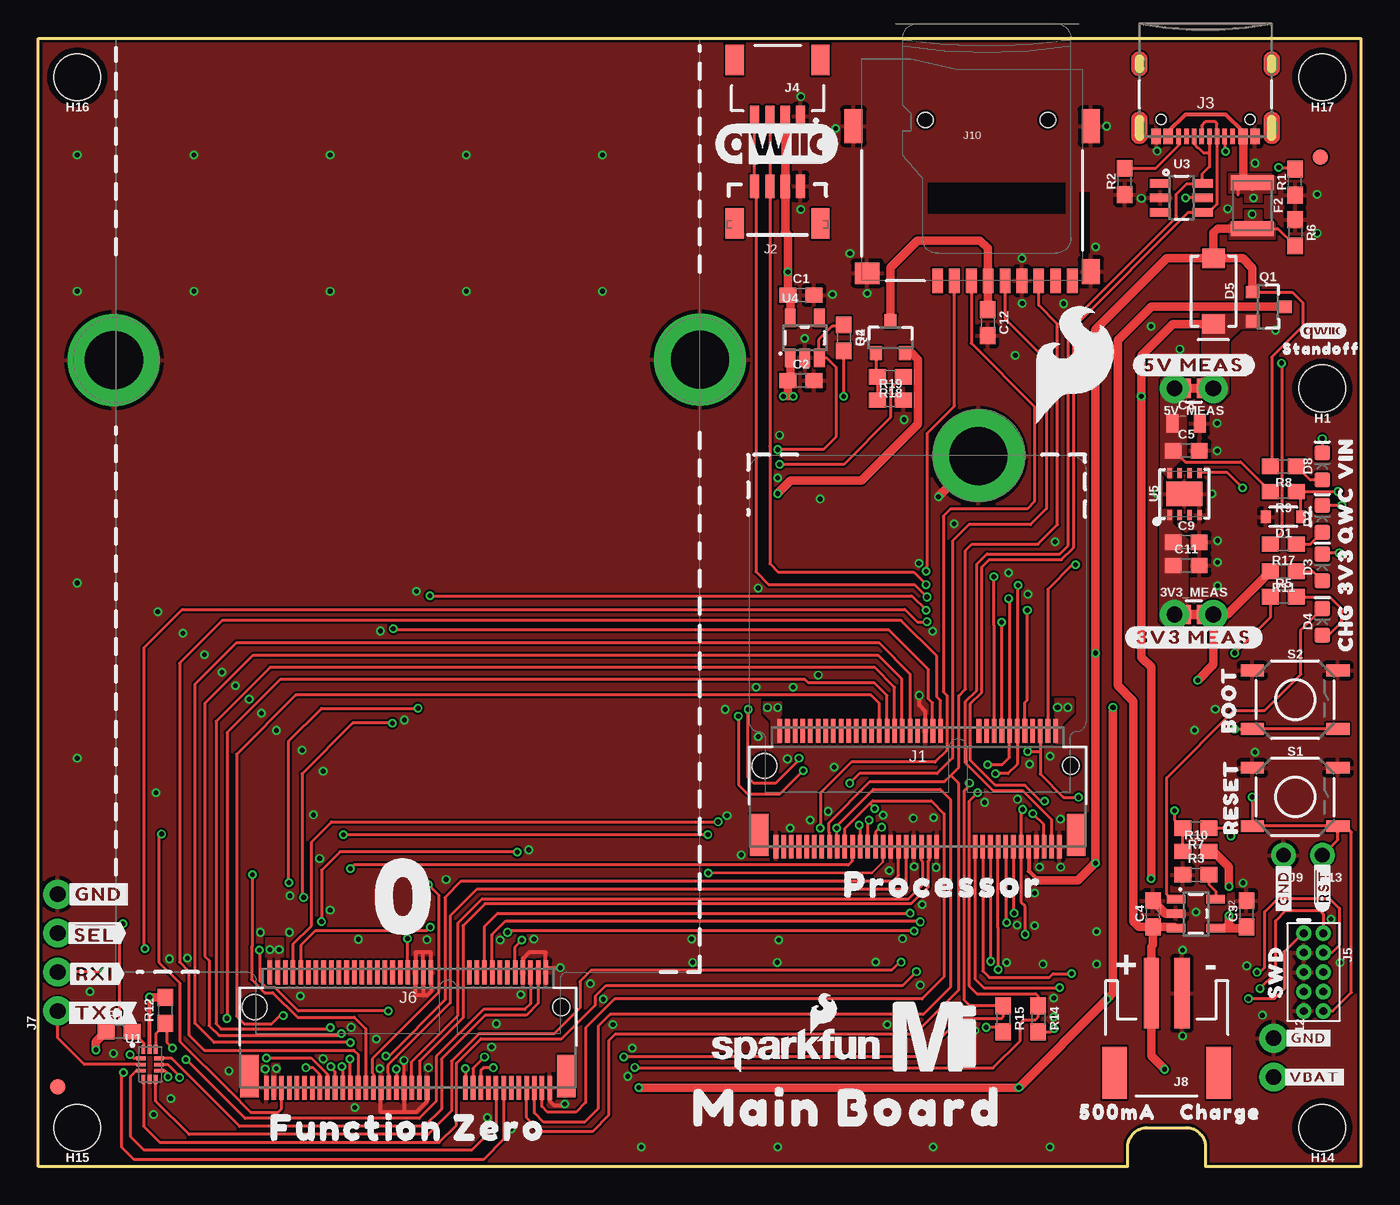
[diagram p1: board, top side]
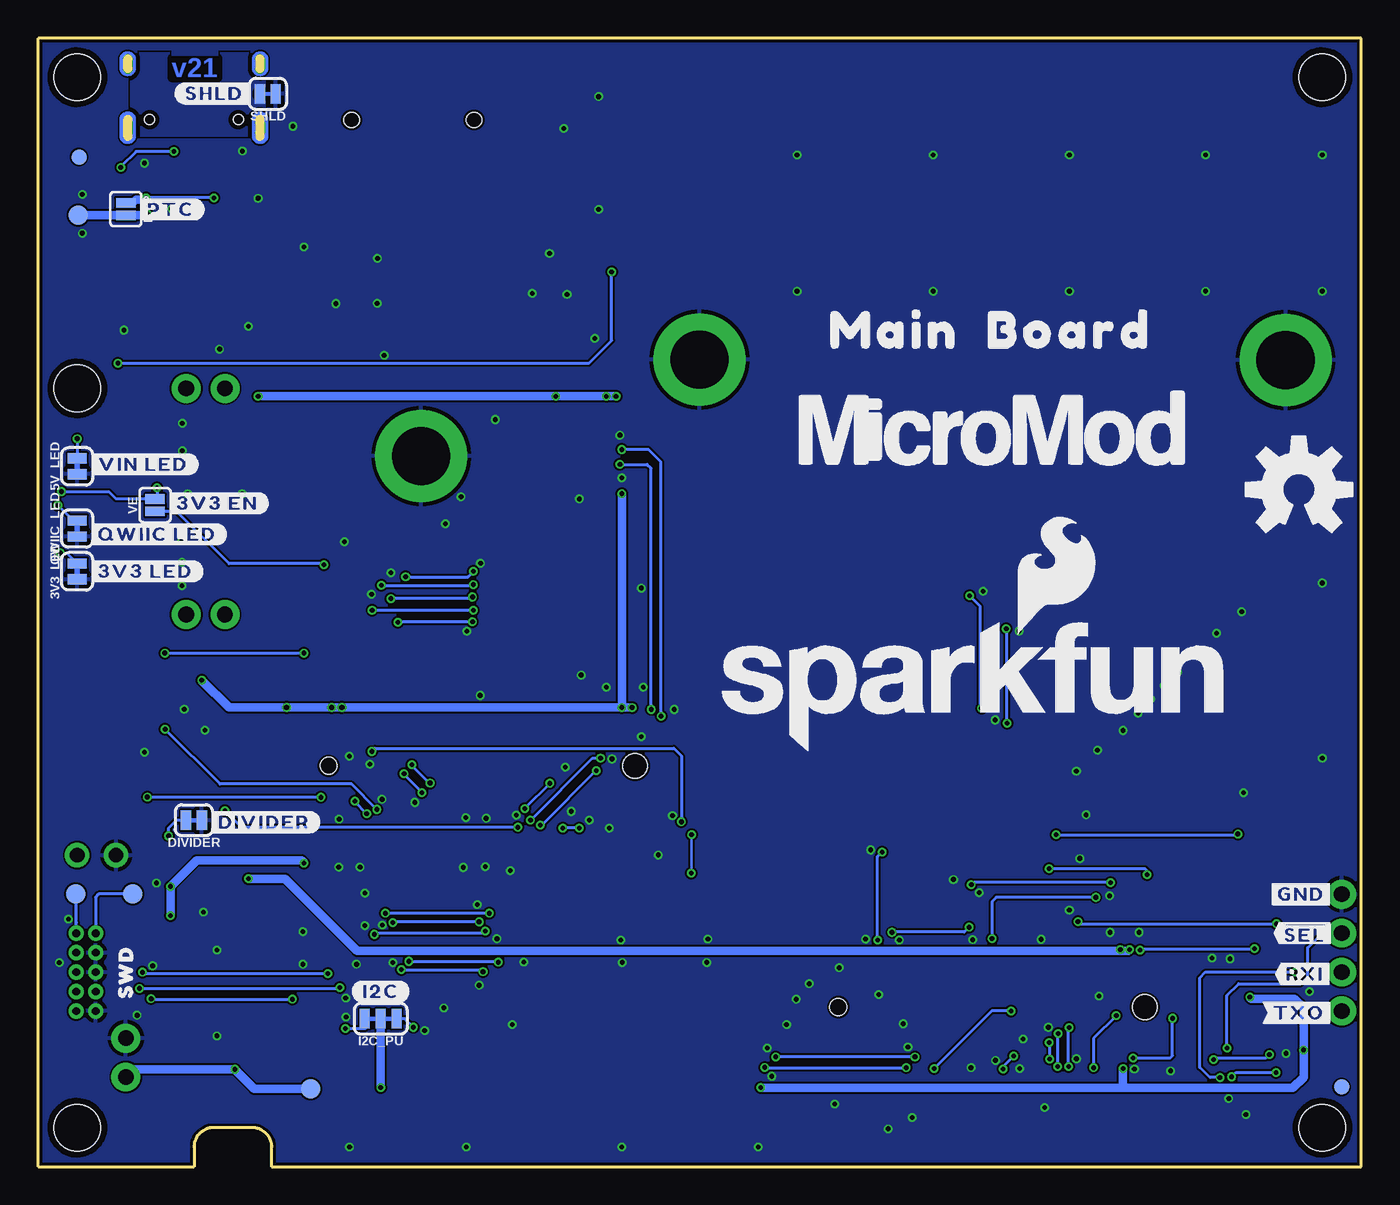
[diagram p2: board, bottom side, seen from below]

Size 86.36 x 73.66 mm. Coordinates in mm from the lower left corner, seen from the top.
Outline: 0,73.66 86.36,73.66 86.36,0 76.2,0 76.2,1.27 arc90 74.93,2.54 72.39,2.54 arc90 71.12,1.27 71.12,0 0,0 0,73.66
Copper layers (1*16): Top 0.035mm / dielectric 1.5mm / Bottom 0.035mm
Design rules "SparkFun-2-Layer-Minimum-JLCPCB": minimum track width 5mil, minimum drill 0.3mm, track to track 5mil, track to pad 5mil, pad to pad 5mil, via to via 5mil, smd to smd 5mil, copper to edge 7mil, drill to drill 7mil, minimum pad ring 5mil, minimum via ring 5mil, stop-mask expansion 2.5mil, vias tented up to drill 25mil, thermal gap 10mil
tRestrict: area 24.8,12.5 to 24.9,12.9; area 25.3,12.5 to 25.5,12.9

### Footprints (pad centres in the part's own frame; a part is rotated, then mirrored left to right if it is on the bottom)
SMT-JUMPER_2_NC_TRACE_SILK = smd 0.66 x 1.27: 1 -0.521,0; 2 0.521,0
COMBO-JUMPER_2_NC_TRACE = smd 0.635 x 1.27: 1 -0.508,0; 2 0.508,0 | drill 1.016 pad 1.88: 3 -1.27,0; 4 1.27,0
SMT-JUMPER_2_NO_SILK = smd 0.635 x 1.27: 1 -0.406,0; 2 0.406,0
0603 = smd 1.1 x 1: 1 -0.85,0; 2 0.85,0
0805 = smd 0.8 x 1.2: 1 -0.9,0; 2 0.9,0
SOD-323 = smd 0.63 x 0.83: A 1.15,0; C -1.15,0
LED-0603 = smd 1 x 1: A -0.877,0; C 0.877,0
SMA-DIODE = smd 1.27 x 1.47: A -2.15,0; C 2.15,0
1210 = smd 1 x 2.8: 1 -1.5,0; 2 1.5,0
FIDUCIAL-1X2 = smd 1 x 1: 1 0,0
STAND-OFF-TIGHT = hole 3.048: 0,0
STAND-OFF-REFLOW-M2.5 = drill 3.8 pad 6: 1 0,0
SMT-JUMPER_3_2-NC_TRACE_SILK = smd 0.66 x 1.27: 1 -1.041,0; 2 0,0; 3 1.041,0
M.2-CONNECTOR-E = smd 0.3 x 1.55: 1 9.25,-5.275; 2 9,2.275; 3 8.75,-5.275; 4 8.5,2.275; 5 8.25,-5.275; 6 8,2.275; 7 7.75,-5.275; 8 7.5,2.275; 9 7.25,-5.275; 10 7,2.275; 11 6.75,-5.275; 12 6.5,2.275; 13 6.25,-5.275; 14 6,2.275; 15 5.75,-5.275; 16 5.5,2.275; 17 5.25,-5.275; 18 5,2.275; 19 4.75,-5.275; 20 4.5,2.275; 21 4.25,-5.275; 22 4,2.275; 23 3.75,-5.275; 32 1.5,2.275; 33 1.25,-5.275; 34 1,2.275; 35 0.75,-5.275; 36 0.5,2.275; 37 0.25,-5.275; 38 0,2.275; 39 -0.25,-5.275; 40 -0.5,2.275; 41 -0.75,-5.275; 42 -1,2.275; 43 -1.25,-5.275; 44 -1.5,2.275; 45 -1.75,-5.275; 46 -2,2.275; 47 -2.25,-5.275; 48 -2.5,2.275; 49 -2.75,-5.275; 50 -3,2.275; 51 -3.25,-5.275; 52 -3.5,2.275; 53 -3.75,-5.275; 54 -4,2.275; 55 -4.25,-5.275; 56 -4.5,2.275; 57 -4.75,-5.275; 58 -5,2.275; 59 -5.25,-5.275; 60 -5.5,2.275; 61 -5.75,-5.275; 62 -6,2.275; 63 -6.25,-5.275; 64 -6.5,2.275; 65 -6.75,-5.275; 66 -7,2.275; 67 -7.25,-5.275; 68 -7.5,2.275; 69 -7.75,-5.275; 70 -8,2.275; 71 -8.25,-5.275; 72 -8.5,2.275; 73 -8.75,-5.275; 74 -9,2.275; 75 -9.25,-5.275 | smd 1.2 x 2.75: A1 10.35,-4.5; A2 -10.35,-4.5 | hole 1.1: 10,0 | hole 1.6: -10,0
JST04_1MM_VERT = smd 0.6 x 1.55: 1 -1.5,0.775; 2 -0.5,0.775; 3 0.5,0.775; 4 1.5,0.775 | smd 1.2 x 2: NC1 -2.8,3.2; NC2 2.8,3.2
USB-C-16P-2LAYER-PADS = smd 0.3 x 1: A5 -1.25,-0.34; A6 -0.25,-0.34; A7 0.25,-0.34; A8 1.25,-0.34; B5 1.75,-0.34; B6 0.75,-0.34; B7 -0.75,-0.34; B8 -1.75,-0.34 | smd 0.6 x 1: GND -3.225,-0.34; GND2 3.225,-0.34; VBUS1 -2.45,-0.34; VBUS2 2.45,-0.34 | drill 0.4 pad 0.6 long: SHLD1 -4.318,-0.915; SHLD2 4.318,-0.915; SHLD3 -4.318,-5.095; SHLD4 4.318,-5.095 | hole 0.65: -2.89,-1.445; 2.89,-1.445
JST04_1MM_RA = smd 0.6 x 1.35: 1 -1.5,0; 2 -0.5,0; 3 0.5,0; 4 1.5,0 | smd 1.2 x 2: NC1 2.8,-3.675; NC2 -2.8,-3.675
2X5-PTH-1.27MM = drill 0.508 pad 1: 1 -2.54,-0.635; 2 -2.54,0.635; 3 -1.27,-0.635; 4 -1.27,0.635; 5 0,-0.635; 6 0,0.635; 7 1.27,-0.635; 8 1.27,0.635; 9 2.54,-0.635; 10 2.54,0.635
M.2-CONNECTOR-E-FUNCTION-STANDARD = smd 0.3 x 1.55: 1 9.25,-5.275; 2 9,2.275; 3 8.75,-5.275; 4 8.5,2.275; 5 8.25,-5.275; 6 8,2.275; 7 7.75,-5.275; 8 7.5,2.275; 9 7.25,-5.275; 10 7,2.275; 11 6.75,-5.275; 12 6.5,2.275; 13 6.25,-5.275; 14 6,2.275; 15 5.75,-5.275; 16 5.5,2.275; 17 5.25,-5.275; 18 5,2.275; 19 4.75,-5.275; 20 4.5,2.275; 21 4.25,-5.275; 22 4,2.275; 23 3.75,-5.275; 32 1.5,2.275; 33 1.25,-5.275; 34 1,2.275; 35 0.75,-5.275; 36 0.5,2.275; 37 0.25,-5.275; 38 0,2.275; 39 -0.25,-5.275; 40 -0.5,2.275; 41 -0.75,-5.275; 42 -1,2.275; 43 -1.25,-5.275; 44 -1.5,2.275; 45 -1.75,-5.275; 46 -2,2.275; 47 -2.25,-5.275; 48 -2.5,2.275; 49 -2.75,-5.275; 50 -3,2.275; 51 -3.25,-5.275; 52 -3.5,2.275; 53 -3.75,-5.275; 54 -4,2.275; 55 -4.25,-5.275; 56 -4.5,2.275; 57 -4.75,-5.275; 58 -5,2.275; 59 -5.25,-5.275; 60 -5.5,2.275; 61 -5.75,-5.275; 62 -6,2.275; 63 -6.25,-5.275; 64 -6.5,2.275; 65 -6.75,-5.275; 66 -7,2.275; 67 -7.25,-5.275; 68 -7.5,2.275; 69 -7.75,-5.275; 70 -8,2.275; 71 -8.25,-5.275; 72 -8.5,2.275; 73 -8.75,-5.275; 74 -9,2.275; 75 -9.25,-5.275 | smd 1.2 x 2.75: A1 10.35,-4.5; A2 -10.35,-4.5 | hole 1.1: 10,0 | hole 1.6: -10,0
1X04_NO_SILK = drill 1.016 pad 1.88: 1 0,0; 2 2.54,0; 3 5.08,0; 4 7.62,0
JST-2-SMD = smd 1 x 4.6: 1 -1,-3.7; 2 1,-3.7 | smd 1.6 x 3.4: NC1 -3.4,1.5; NC2 3.4,1.5
1X01_NO_SILK = drill 0.95 pad 1.6: 1 0,0
MICROSD-EXTERNALPIN = smd 0.7 x 1.6: 1 2.25,10.5; 2 1.15,10.5; 3 0.05,10.5; 4 -1.05,10.5; 5 -2.15,10.5; 6 -3.25,10.5; 7 -4.35,10.5; 8 -5.45,10.5; 9 -6.55,10.5 | smd 1.2 x 1.6: 10 -7.75,9.9 | smd 1.2 x 2.2: 11 -7.75,0.4; 12 7.75,0.4 | smd 1.6 x 1.4: 13 6.85,10 | hole 1: 3.05,0; -4.95,0
1X02_NO_SILK = drill 1.016 pad 1.88: 1 0,0; 2 2.54,0
SOT23-3 = smd 0.8 x 0.9: 1 -0.95,-1; 2 0.95,-1; 3 0,1.1
TACTILE_SWITCH_SMD_5.2MM = smd 1.524 x 0.762: 1 -2.794,1.905; 2 2.794,1.905; 3 -2.794,-1.905; 4 2.794,-1.905
PAD.03X.05 = smd 1.27 x 1.27: 1 0,0
STG3856 = smd 0.6 x 0.25: P1 -0.59,0.41; P2 -0.59,0.01; P3 -0.59,-0.39; P7 0.58,-0.39; P8 0.58,0.01; P9 0.58,0.41 | smd 0.25 x 0.6: P4 -0.42,-0.96; P5 -0.02,-0.96; P6 0.38,-0.96; P10 0.38,1.01; P11 -0.02,1.01; P12 -0.42,1.01
SOT23-5 = smd 0.55 x 1.2: 1 -0.95,-1.3; 2 0,-1.3; 3 0.95,-1.3; 4 0.95,1.3; 5 -0.95,1.3
SOT-23-6 = smd 0.55 x 1.35: 1 -0.95,-1.375; 2 0,-1.375; 3 0.95,-1.375; 4 0.95,1.375; 5 0,1.375; 6 -0.95,1.375
SOT25 = smd 0.7 x 1.2: 1 -0.95,-1.3; 2 0,-1.3; 3 0.95,-1.3; 4 0.95,1.3; 5 -0.95,1.3
UDFN-8 = smd 0.3 x 0.65: 1 -0.975,-1.375; 2 -0.325,-1.375; 3 0.325,-1.375; 4 0.975,-1.375; 5 0.975,1.375; 6 0.325,1.375; 7 -0.325,1.375; 8 -0.975,1.375 | smd 2.35 x 1.6: EP 0,0

### Placement (x,y rotation side)
3V3_LED  83.82,38.86 90 bottom
3V3_MEAS  75.44,36.04 0 top
5V_LED  83.82,45.72 90 bottom
5V_MEAS  75.44,50.8 180 top
BYP  80.64,62.51 270 bottom
C1  49.78,56.9 0 top
C2  49.78,51.31 0 top
C3  78.87,16.51 90 top
C4  72.77,16.51 90 top
C5  74.93,46.74 0 top
C8  74.93,48.51 0 top
C9  74.93,40.77 0 top
C11  74.93,39.24 0 top
C12  61.98,55.09 270 top
D1  81.28,42.42 180 top
D2  83.82,42.29 90 top
D3  83.82,39.12 90 top
D4  83.82,35.56 90 top
D5  76.71,57.15 270 top
D8  83.82,45.72 90 top
DIVIDER  76.2,22.61 180 bottom
F2  79.25,62.74 270 top
FD1  1.27,5.21 180 bottom
FD2  1.27,5.21 180 top
FD3  83.69,65.91 270 top
FD4  83.69,65.91 90 bottom
FRAME1  16.51,-31.75 0 top  (outside the outline)
FRAME2  FRAME-LEDGERNO_FOOTPRINT  [DUMMY]  16.51,-31.75 0 top  (outside the outline)
H1  STAND-OFFTIGHT  [STAND-OFF-TIGHT]  83.82,50.8 180 top
H2  4.94,52.65 180 top
H4  43.19,52.68 90 top
H8  61.36,46.39 90 top
H14  83.82,2.54 180 top
H15  2.54,2.54 180 top
H16  2.54,71.12 180 top
H17  83.82,71.12 180 top
I2C_PU  64.01,9.65 180 bottom
J1  57.4,26.16 0 top
J2  48.26,64.77 180 top
J3  76.2,66.9 180 top
J4  48.26,68.58 180 top
J5  83.25,12.69 270 top
J6  24.13,10.41 0 top
J7  1.27,10.16 90 top
J8  73.66,7.62 180 top
J9  81.28,20.32 180 top
J10  60.96,68.33 180 top
J12  80.64,8.38 270 top
J13  83.82,20.32 180 top
LOGO1  48.21,66.75 0 top
LOGO2  25.4,31.29 0 bottom
LOGO3  4.06,44.2 0 bottom
Q1  80.26,56.13 270 top
Q2  55.63,54.1 0 top
QWIIC_LED  83.82,41.66 90 bottom
R1  82.04,64.26 90 top
R2  70.92,64.31 90 top
R3  75.56,19.05 0 top
R4  52.58,54.1 270 top
R5  81.28,37.21 0 top
R6  82.04,60.96 270 top
R7  75.56,22.1 180 top
R8  81.28,45.72 180 top
R9  81.28,44.07 180 top
R10  75.56,20.57 0 top
R11  81.28,38.86 180 top
R12  8.31,10.21 90 top
R13  5.28,8.81 0 top
R14  65.28,9.65 270 top
R15  62.99,9.65 270 top
R17  81.28,40.64 180 top
R18  55.63,51.56 180 top
R19  55.63,50.04 0 top
S1  82.04,24.13 0 top
S2  82.04,30.48 0 top
SHLD  71.37,70.03 180 bottom
TP1  83.92,17.8 180 bottom
TP2  80.19,17.79 0 bottom
TP3  68.58,5.08 90 bottom
TP4  83.74,62.13 180 bottom
U1  7.29,6.65 0 top
U2  75.56,16.51 270 top
U3  74.63,63.25 270 top
U4  50.04,54.1 0 top
U5  74.83,43.92 0 top
U$1  [#TXO#7]  4.06,10.03 0 top
U$2  [#RXI#6]  3.68,12.57 0 top
U$3  [#PTC#15]  77.72,62.48 0 bottom
U$4  [3V332533]  85.34,38.86 90 top
U$5  [VIN32532]  85.34,46.23 90 top
U$6  [CHG32531]  85.34,35.18 90 top
U$7  [#SHLD#501]  74.88,70.05 0 bottom
U$8  [BOOT32541]  77.72,30.48 90 top
U$9  [RESET32540]  77.85,24.13 90 top
U$10  [PROCESSOR525]  59.05,18.41 0 top
U$11  [FUNCTION_ZERO520]  24.13,2.54 0 top
U$12  [##SEL##5]  3.68,15.24 0 top
U$13  [MAIN523]  30.48,54.61 0 bottom
U$14  [MICROMOD_MI_LOGO_1]  58.55,8.51 0 top
U$15  [0523]  24.13,17.53 0 top
U$16  [#GND#3]  3.94,17.78 0 top
U$17  [MICROMOD_LOGO_1]  24.13,48.26 0 bottom
U$18  [BOARD524]  19.05,54.61 0 bottom
U$19  [##SEL##3]  3.68,15.24 0 bottom
U$20  [#RXI#4]  3.68,12.57 0 bottom
U$21  [MAIN_BOARD5523]  52.83,3.84 0 top
U$22  [QWIIC_3MM]  83.87,54.56 0 top
U$23  [STANDOFF501]  83.74,53.39 0 top
U$24  [SFE_LOGO_FLAME_.3]  67.69,52.32 0 top
U$25  [SWD6522]  80.77,12.7 90 top
U$26  [#3V3_MEAS#6522]  75.44,34.54 0 top
U$27  [CHARGE501]  77.17,3.56 0 top
U$28  [#TXO#5]  4.06,10.03 0 bottom
U$29  [#GND#3]  3.94,17.78 0 bottom
U$30  [#I2C#501]  64.01,11.43 0 bottom
U$31  [#5V_MEAS#6522]  75.44,52.32 0 top
U$32  [SWD6522]  80.64,12.7 90 bottom
U$33  [500MA6520]  70.48,3.56 0 top
U$34  [SFE_LOGO_NAME_FLAME_.1]  49.53,7.62 0 top
U$35  [QWC4]  85.34,42.55 90 top
U$36  [#GND#10]  82.93,8.38 0 top
U$37  [#GND#10]  81.28,18.16 90 top
U$38  [##RST##8]  83.82,18.29 90 top
U$39  [#VBAT#9]  83.31,5.84 0 top
U$49  [#3V3_EN#23]  74.68,43.31 0 bottom
U$50  [#3V3_LED#22]  79.38,38.86 0 bottom
U$51  [#QWIIC_LED#22]  78.61,41.27 0 bottom
U$52  [#DIVIDER#23]  71.63,22.48 0 bottom
U$53  [#VIN_LED#24]  79.5,45.85 0 bottom
VE  78.74,43.18 90 bottom

### Tracks (layer width: path | path; a pad name or v marks a point on that pad's centre or on a via)
3.3V  (via drill 0.3, 0.35)
  Top 0.203: J5.1 82.54,15.23 81.33,14.02 81.33,11.6 80.69,10.96 v78.99,10.96
  Top 0.254: U1.P11 v7.27,11.06
  Top 0.559: v70.16,29.97 70.16,11.3 v69.77,10.92 69.72,10.92 69.72,10.87 v64.01,5.16 63.98,5.13 39.22,5.13 v39.19,5.16 | v7.27,11.06 R12.2 | v75.69,31.75 76.71,32.77 3V3_MEAS.4 | v48.26,43.94 49.1,44.78 53.72,44.78 57.43,48.49 57.43,52.69 57.02,53.1 Q2.2 | 3V3_MEAS.2 3V3_MEAS.4 | R11.2 77.61,36.04 3V3_MEAS.4 | R13.1 3.76,8.14 v3.76,7.62
  Bottom 0.203: TP2.1 82.41,17.79 82.61,17.59 J5.1 | v78.99,10.96 78.96,10.92 v69.77,10.92
  Bottom 0.559: v48.26,43.94 48.26,31.98 v48.26,29.97 | v75.69,31.75 73.91,29.97 v70.16,29.97 v66.55,29.97 v48.26,29.97 | v39.19,5.16 15.6,5.16 15.54,5.21 | v15.54,6.4 15.54,5.21 | I2C_PU.2 v64.01,5.16 | 15.54,5.21 15.47,5.13 4.47,5.13 3.76,5.84 v3.76,7.62 3.76,10.36 4.36,10.96 7.17,10.96 v7.27,11.06 | v48.26,29.97 v47.6,29.97
  other vias: 67.21,29.97
  pour Top (isolate 0.305, no thermals): 47.84,29.15 47.85,29.11 47.85,27.74 48.49,27.74 48.49,30.45 47.37,30.45 47.37,29.62
  pour Top (isolate 0.305, no thermals): 66.29,27.69 66.8,27.69 66.8,28.88 66.82,28.92 67.56,29.67 67.56,30.48 66.29,30.48
  pour Top (no thermals): 15.55,6.14 15.57,6.15 15.75,6.15 15.75,6.71 15.24,6.71 15.24,4.6 15.52,4.6 15.52,6.1 15.53,6.12
3.3V_EN  (via drill 0.3)
  Top 0.203: v67.72,39.29 67.51,39.29 65.9,37.69 J1.4
  Bottom 0.203: v67.72,39.29 67.79,39.37 73.91,39.37 77.32,42.77 VE.1
3.3V_EN_VE  (via drill 0.3)
  Top 0.203: U5.5 75.85,45.34 77.6,45.34 v78.61,44.32 | v84.84,44.07 R9.1 82.43,43.77 D1.C
  Bottom 0.203: v78.61,44.32 78.61,43.71 VE.2 81.28,43.59 81.76,44.07 v84.84,44.07
3.3V_QWIIC  (via drill 0.3)
  Top 0.203: v81.15,52.45 81.21,52.4 81.21,41.42 R17.2
  Top 0.559: J4.2 J2.2 48.76,61.01 48.74,60.99 48.93,60.79 v48.93,58.42 C1.1 49.09,56.74 U4.5
  Bottom 0.203: v81.15,52.45 50.42,52.45 48.93,53.94 v48.93,58.42
3V3_MEAS
  pour Top (no thermals): 73.74,35.15 74.57,35.15 75.06,35.64 75.06,40.92 74.04,41.94 74.04,42.85 73.23,42.85 73.23,35.66
!BOOT!  (via drill 0.3)
  Top 0.203: S2.4 S2.3 79.22,28.55 v78.08,28.55 | v64.26,23.32 64.14,23.19 64.14,20.91 J1.11 64.15,17.26 64.4,17.01 64.4,15.17 v64.42,15.16 | v57.17,15.37 57.11,15.43 30.77,15.43 v30.63,15.29 | v25.6,15.62 25.38,15.39 18.09,15.39 17.13,14.44 J6.66
  Bottom 0.203: v64.26,23.32 65.91,24.97 74.5,24.97 v78.08,28.55 | v57.17,15.37 57.29,15.25 64.33,15.25 v64.42,15.16 | v30.63,15.29 30.61,15.32 25.91,15.32 v25.6,15.62
!CS0!-PROCESSOR  (via drill 0.3)
  Top 0.203: J1.55 53.15,19.96 52.88,19.68 20.6,19.68 v20.37,19.46 | J6.49 21.38,9 20.62,9.75 16.92,9.75 15.31,11.36 14.78,11.36 13.92,12.21 13.92,14.33 13.97,14.38 v13.97,19.05
  Bottom 0.203: v20.37,19.46 14.12,19.46 13.97,19.3 v13.97,19.05
!DFU-FC0!  (via drill 0.3)
  Top 0.203: v31.57,14.8 31.13,14.35 J6.10 | v18.49,16 18.49,19.35 19.69,20.55 31.17,20.55 31.19,20.52 v31.27,20.52 | v5.54,15.85 5.29,15.6 5.29,9.51 5.98,8.81 R13.2 6.87,8.08 U1.P12
  Bottom 0.203: v31.27,20.52 31.29,20.52 31.57,20.24 v31.57,14.8 | v18.49,16 18.34,15.85 v5.54,15.85
!RESET!  (via drill 0.3)
  Top 0.203: v67.92,24.11 66.93,24.11 65.4,25.63 65.4,27.1 | J1.6 65.4,27.1 | v79.25,24.13 S1.3 S1.4 | J5.10 84.52,10.15 85.72,11.36 85.72,21.84 85.34,22.23 S1.4 | v64.59,27.1 65.4,27.1 | J6.68 16.63,14.53 17.83,15.73 17.83,21.19 19.15,22.5 v44.37,22.5 | J13.1 84.84,21.34 S1.4
  Bottom 0.203: v67.92,24.11 79.22,24.11 v79.25,24.13 | v64.59,27.1 64.39,27.3 44.86,27.3 44.37,26.82 v44.37,22.5
!SEL!/2IN  (via drill 0.3)
  Top 0.203: U1.P10 7.67,8.67 8.31,9.31 R12.1 8.38,9.29 8.38,8.13 v8.76,7.75
  Bottom 0.203: v8.76,7.75 8.76,11.18 8,11.94 3.94,11.94 3.49,12.38 3.49,14.29 2.54,15.24 J7.3
A0-PROCESSOR  (via drill 0.3)
  Top 0.203: J1.34 58.38,28.46 58.38,30.27 58.12,30.54 58.12,32.44 55.53,35.02 23.25,35.02 v23.16,35.1 | J6.38 24.11,12.71 v24.11,14.88 | v23.11,28.96 20.53,28.96 17.22,25.64 17.22,17.68 v17.32,17.58
  Bottom 0.203: v23.16,35.1 23.11,35.05 v23.11,28.96 | v17.32,17.58 23.82,17.58 24.11,17.3 v24.11,14.88
CTS1-PROCESSOR  (via drill 0.3)
  Top 0.203: v57.58,15.98 57.53,16.03 30.5,16.03 29.63,15.15 J6.16 | J1.15 63.15,16.02 63.21,15.96 v63.21,15.93
  Bottom 0.203: v57.58,15.98 63.16,15.98 v63.21,15.93
D0-PROCESSOR  (via drill 0.3)
  Top 0.203: J1.10 64.4,30.29 64.57,30.45 v64.57,36.32 | v25.45,18.41 26.14,17.73 26.14,11.38 21.79,7.04 21.79,6.12 21.88,6.04 J6.47 | v25.55,37.26 57.03,37.26 v57.97,36.33 | v24.79,29.92 18.49,29.92 16.36,27.79 v16.36,18.54
  Bottom 0.203: v25.55,37.26 24.89,36.6 24.89,30.02 v24.79,29.92 | v25.45,18.41 25.32,18.54 v16.36,18.54 | v64.57,36.32 v57.97,36.32 v57.97,36.33
D1-PROCESSOR/SD_CARD_!CS!  (via drill 0.3)
  Top 0.203: J1.18 62.4,35.3 62.38,35.32 v62.38,38.51 | v57.96,38.86 57.96,39.14 58.04,39.22 58.04,47.88 59.81,49.65 J10.2
  Bottom 0.203: v62.38,38.51 58.32,38.51 v57.96,38.86
D+
  Top 0.203: J1.3 66.15,22.64 64.26,24.54 62.34,24.54 60.53,26.34 60.53,30.36 61.27,31.1 61.27,39.33 61.94,40.01 66.67,40.01 67.23,40.56 67.23,54.92 74.3,61.99 74.3,63.5 74.93,64.14 75.94,64.14 U3.6 76,64.82 76.45,65.28 76.45,66.17 | J3.B6 75.45,66.77 75.7,66.52 75.72,66.52 76.07,66.17 76.45,66.17 | J3.A6 76.45,66.17
D-  (via drill 0.3)
  Top 0.203: v65.68,23.85 65.46,23.85 64.41,24.89 62.48,24.89 60.86,26.52 60.86,30.23 61.59,30.96 61.59,39.14 62.08,39.62 66.8,39.62 67.56,40.39 67.56,54.79 75.07,62.3 U3.4 76.42,62.3 76.95,62.82 J3.B7 76.95,68.08 76.83,68.2 76.2,68.2 75.95,67.95 J3.A7 | v64.92,23.04 65.63,22.33 65.63,20.91 J1.5
  Bottom 0.203: v64.92,23.04 65.68,23.8 v65.68,23.85
G0-PROCESSOR  (via drill 0.3)
  Top 0.203: J1.40 56.9,32.17 54.86,34.21 12.94,34.21 10.24,31.5 10.24,12.7 10.24,9.35 11.48,8.1 v20.37,8.1 | J6.53 20.34,5.17 v20.34,7.01
  Bottom 0.203: v20.37,8.1 20.34,8.08 v20.34,7.01
G1-PROCESSOR  (via drill 0.3)
  Top 0.203: v19.79,8.69 19.66,8.56 11.79,8.56 11.15,9.21 11.15,13.46 10.87,13.74 10.87,30.24 13.98,33.35 54.85,33.35 56.36,31.84 56.36,28.48 J1.42 | v19.81,6.53 19.88,6.46 J6.55
  Bottom 0.203: v19.81,6.53 19.79,6.55 v19.79,8.69
G2-PROCESSOR  (via drill 0.3)
  Top 0.203: v19.07,9.07 19,8.99 11.93,8.99 11.6,9.32 11.6,29.07 15.13,32.6 54.61,32.6 54.61,32.59 55.9,31.29 J1.44 | v19.1,6.53 19.1,6.45 19.38,6.17 J6.57
  Bottom 0.203: v19.1,6.53 19.1,9.04 v19.07,9.07
G3-PROCESSOR  (via drill 0.3)
  Top 0.203: v14.88,7.09 17.8,7.09 18.88,6.01 J6.59 | J1.46 55.4,30.75 54.58,31.58 50.26,31.58 50.05,31.8 15.78,31.8 12.32,28.34 v12.32,9.68
  Bottom 0.203: v12.32,9.68 12.32,7.24 12.47,7.09 v14.88,7.09
G4-PROCESSOR  (via drill 0.3)
  Top 0.203: J1.48 54.9,30.24 54.36,30.79 16.82,30.79 12.95,26.92 12.95,9.81 13.43,9.34 15.24,9.34 15.76,9.86 v15.99,9.86 | J6.61 18.38,6.01 17.94,6.45 v17.48,6.45
  Bottom 0.203: v15.99,9.86 17.48,8.37 v17.48,6.45
GND  (via drill 0.3)
  Top 0.203: J6.39 v23.88,6.93
  Top 0.254: 25.13,11.18 J6.34 25.13,13.93 arc-45 25.15,13.97 | 25.13,11.18 24.63,11.18 J6.36 24.63,13.95 arc-45 24.64,13.97 25.15,13.97 | 25.13,11.18 25.38,11.18 25.63,11.43 J6.32 25.63,13.97 25.15,13.97 | J6.2 33.13,12.95 | 33.13,12.95 33.13,13.97 32.03,13.97 31.63,13.57 J6.8 | v34.09,12.98 34.06,12.95 33.13,12.95 | J6.1 33.38,4.29 33.66,4.01 34.29,4.01 v34.37,4.09 | J1.36 57.9,29.73 57.51,30.12 57.51,30.74 v57.52,30.76 | J6.39 23.88,3.56 | 23.88,3.56 22.35,3.56 22.35,5.11 J6.45 | J6.33 25.38,4.27 24.67,3.56 23.88,3.56
  Top 0.559: U2.2 73.62,16.51 C4.2 | v58.76,43.74 61.36,46.34 H8.1
  other vias: 76.99,40.87 78.64,18.52 80.77,54.61 79.91,9.88 64.24,56.36 64.21,59.28 63.22,13.31 65.05,15.72 66.29,11 50.39,22.61 61.77,23.77 66.73,22.68 76.83,29.87 54.1,57 63.92,23.97 51.04,43.58 76.99,39.45 65.58,13.21 42.65,14.85 44.96,22.91 54.66,13.36 51.57,23.19 66.75,19.56 65.35,19.56 56.41,14.87 20.42,9.09 58.62,19.53 79.43,27.05 19.05,16.74 25.36,14.81 49.08,22.09 14.81,6.38 57.58,11.84 29.59,7.8 25.48,6.45 22.3,6.4 45.9,20.35 17.96,22.96 16.43,17.68 24.94,17.88 30.15,14.78 32.36,14.86 29.9,9.32 29.31,3.2 18.59,7.04 38.79,7.75 38.48,5.89 48.34,14.8 23.9,29.16 24.69,37.57 66.05,26.79 64.71,26.26 69.01,60.05 52.98,59.61 52.04,67.77 69.75,67.92 20.9,14.83 73.05,43.92 75.49,28.5 84.99,13.31 49.78,62.48 49.78,69.85 61.14,8.89 73.03,66.29 79.43,65.51 83.49,60.93 83.49,63.47 76.61,43.92 74.52,53.37 76.96,46.74 76.96,48.51 50.04,54.08 51.84,56.95 36.83,66.04 72.01,63.22 27.94,66.04 27.94,57.15 36.83,57.15 19.05,66.04 19.05,57.15 10.16,57.15 10.16,66.04 48.39,47.75 20.68,3.86 30.89,2.46 7.53,3.4 48.23,13.33 42.72,13.33 50.93,32.09 51.95,26.08 49.28,31.29 22.34,34.97 12.44,6.25 7.67,24.41 32.03,20.68 55.55,19.33 8.65,4.45 4.9,7.39 63.9,15.76 47,28.06 17.22,27.18 36.88,10.92 66.27,9.75 78.89,13.11 84.39,16.15 18.36,20.12 8.56,13.56 9.73,13.61 14.5,15.29 16.38,15.29 57.12,22.73 58.45,22.78 57.18,19.58 57.71,17.09 65.05,17.86 26.62,18.75 66.38,40.79 59.78,41.96 66.93,56.34 63.33,38.76 64.6,37.36 57.49,39.39 58.38,34.95 22.07,8.33 31.5,11.23 17.12,11.13 14.55,29.59 59.88,10.36 9.45,34.82 10.85,33.43 11.99,32.28 12.88,31.39 13.77,30.51 15.54,28.47 7.8,36.22 18.59,25.81 69.09,15.34 69.09,13.21 55.15,22.93 48.91,26.61 46.86,31.29 76.99,37.92 63.78,52.96 77.65,62.53 3.38,11.43 75.59,16.61 56.52,48.77 48.26,44.96 72.64,54.86 36.04,11.93 37.52,9.27 55.42,9.27 74.7,8.53 74.7,14.12 2.54,66.04 2.54,57.15 2.54,38.1 2.54,26.67 39.37,1.27 48.26,1.27 58.42,1.27 66.04,1.27 44.84,29.84 46.99,37.77
  pour Top (rank 4): 0,0 86.36,0 86.36,73.66 0,73.66
  pour Bottom (rank 4): 0,0 86.36,0 86.36,73.66 0,73.66
HOST_D+
  Top 0.203: J6.35 24.88,6.88 27.72,9.72 27.72,15.72 29.16,17.15 56.98,17.15 58.06,18.24 58.06,19.89 58.15,19.98 J1.35
HOST_D-
  Top 0.203: J6.37 24.38,6.85 27.39,9.86 27.39,15.91 28.97,17.49 56.82,17.49 57.73,18.41 57.73,19.89 57.65,19.98 J1.37
I2C_!INT!  (via drill 0.3)
  Top 0.203: v58.01,35.56 57.38,35.56 56.57,36.37 9.4,36.37 6.91,33.88 6.91,14.28 v6.96,14.22 | J1.16 62.9,35.52 v62.89,35.53 | v27.87,6.4 v27.88,6.39 J6.23 | v22.86,10.16 16.98,10.16 15.45,11.69 14.91,11.69 14.48,12.12 14.48,14.07 v14.43,14.12
  Bottom 0.203: v58.01,35.56 62.87,35.56 v62.89,35.54 v62.89,35.53 | v22.86,10.16 24.11,10.16 v27.87,6.4 | v14.43,14.12 14.33,14.22 v6.96,14.22
I2C_SCL  (via drill 0.3)
  Top 0.203: v61.98,26.24 62.92,26.24 63.4,26.73 J1.14 63.4,37.02 v63.34,37.08 | v60.78,25.04 60.78,24.89 60.43,24.54 60.43,10.89 60.81,10.5 R15.1 62.99,9.78 62.87,9.65 60.15,9.65 57.66,7.16 v38.23,7.16 | v58.01,37.19 57.2,38 47.68,38 46.84,38.84 46.84,63.92 J2.4 J4.4 46.74,68.56 | v29.13,7.16 28.38,6.41 J6.21
  Bottom 0.203: v61.98,26.24 61.98,26.19 60.83,25.04 v60.78,25.04 | v29.13,7.16 v38.23,7.16 | v58.01,37.19 58.12,37.08 v63.34,37.08
I2C_SCL1-PROCESSOR/QWIIC_EN  (via drill 0.3)
  Top 0.203: R4.1 52.49,54.86 51.82,54.86 50.93,53.98 50.93,52.86 U4.3 51.47,52.8 52.07,52.2 52.07,47.62 51.26,46.81 v48.26,46.81 | v49.94,25.86 48.41,24.33 46.3,24.33 45.72,24.92 45.72,29.38 v45.7,29.4 | J1.53 53.65,22.21 v53.59,22.28
  Bottom 0.203: v49.94,25.86 53.47,22.32 53.54,22.32 v53.59,22.28 | v48.26,46.81 46.53,46.81 45.72,46 45.72,29.41 v45.7,29.4
I2C_SDA  (via drill 0.3)
  Top 0.203: v62.48,25.65 63.3,25.65 63.9,26.26 J1.12 63.95,28.49 v63.95,37.95 | v61.32,24.41 60.76,23.85 60.76,11.79 61.26,11.28 65.11,11.28 65.28,11.11 R14.1 65.28,9.78 65.08,9.58 64.32,9.58 64.1,9.37 64.1,8.22 62.32,6.44 39.03,6.44 38.99,6.48 v38.94,6.48 | v57.96,38 57.15,38.81 48.3,38.81 47.75,39.36 47.75,47.02 47.76,47.03 J2.3 J4.3 | J6.19 28.88,6.27 29.06,6.45 v29.7,6.45
  Bottom 0.203: v62.48,25.65 62.48,25.6 61.32,24.43 v61.32,24.41 | v38.94,6.48 38.91,6.45 v29.7,6.45 | v63.95,37.95 58.02,37.95 v57.96,38
I2C_SDA1-PROCESSOR/!SD_ENABLE!  (via drill 0.3)
  Top 0.203: R18.1 56.4,51.56 55.63,50.79 55.63,48.9 52.58,45.85 v48.39,45.85 | J1.51 54.15,22.53 v54.23,22.61 | v49.66,26.67 49.66,26.54 48.13,25.02 46.74,25.02 46.33,25.43 46.33,29.82 v46.35,29.84
  Bottom 0.203: v48.39,45.85 46.61,45.85 46.35,45.59 v46.35,29.84 | v54.23,22.61 50.16,26.67 v49.66,26.67
N$2  (via drill 0.3)
  Top 0.203: v83.82,47.52 D8.C
  Bottom 0.203: v83.82,47.52 5V_LED.2
N$3
  Top 0.203: R11.1 83.2,38.86 D3.A
N$4
  Top 0.203: J3.B5 74.45,66.68 72.94,65.16 R2.2
N$5  (via drill 0.3)
  Top 0.203: v77.5,66.27 77.45,66.31 J3.A5 | v80.97,65.23 81.93,65.23 R1.2
  Bottom 0.203: v77.5,66.27 79.98,66.27 80.97,65.28 v80.97,65.23
N$6
  Top 0.203: R3.2 76.42,18.42 76.86,17.97 U2.5
N$7  (via drill 0.3)
  Top 0.203: R7.1 77.34,22.1 v77.85,21.59
  Bottom 0.203: DIVIDER.2 77.34,22.61 77.85,22.1 v77.85,21.59
N$8
  Top 0.203: D4.C 82.42,35.04 82.42,32.13 80.06,29.77 78.05,29.77 73.66,25.38 73.66,17.78 73.98,17.46 U2.1
N$9
  Top 0.203: D4.A 84.21,34.68 85.09,35.56 85.09,36.4 84.33,37.17 82.17,37.17 R5.2
N$10  (via drill 0.3)
  Top 0.203: v84.93,40.06 83.88,40.06 D3.C
  Bottom 0.203: v84.93,40.06 84.49,40.06 3V3_LED.2
N$11  (via drill 0.3)
  Top 0.203: R14.2 66.1,8.8 v66.32,9.02
  Bottom 0.203: I2C_PU.3 65.02,9.63 65.02,9.02 v66.32,9.02
N$12
  Top 0.203: R8.1 83.01,44.84 D8.A
N$13  (via drill 0.3)
  Top 0.203: R15.2 62.7,9.09 v61.87,9.09
  Bottom 0.203: v61.87,9.09 62.43,9.65 I2C_PU.1
N$14
  Top 0.203: R17.1 83.05,40.64 D2.A
N$15  (via drill 0.3)
  Top 0.203: D2.C 83.83,43.18 v85.09,43.18
  Bottom 0.203: QWIIC_LED.2 84.09,42.18 v85.09,43.18
N$16
  Top 0.559: Q2.3 55.63,58.67 57.4,60.45 61.47,60.45 61.98,59.94 61.98,57.86 | 61.98,57.86 J10.4 | C12.1 61.98,57.86
N$18
  Top 0.203: R19.1 R18.2 54.68,51.66 Q2.1
PROCESSOR_CAN-RX
  Top 0.203: J1.41 56.65,18.48 56.27,18.09 28.61,18.09 26.89,16.38 26.89,10.69 23.37,7.17 23.37,7.16 22.81,6.6 22.81,6.12 22.88,6.05 J6.43
PROCESSOR_CAN-TX  (via drill 0.3)
  Top 0.203: v22.69,7.21 22.89,7.21 26.54,10.87 26.54,17.57 27.61,18.64 55.78,18.64 56.15,19.02 J1.43 | v23.37,6.38 23.38,6.36 J6.41
  Bottom 0.203: v22.69,7.21 23.37,6.54 v23.37,6.38
PWM0-PROCESSOR
  Top 0.203: J6.51 20.88,7.31 20.6,7.59 10.83,7.59 9.83,8.59 9.83,12.75 9.22,13.36 9.22,32.86 12.01,35.66 56.32,35.66 58.65,33.33 58.65,30.67 58.9,30.42 J1.32
PWR_EN0  (via drill 0.3)
  Top 0.178: J1.47 55.15,19.9 54.42,19.16 v43.74,19.16
  Top 0.203: v43.71,21.67 v19.91,21.67 | v8.05,21.72 7.87,21.54 7.87,13.35 9.24,11.98 9.24,8.19 12.45,4.98 | 12.45,4.98 | 12.45,4.98 13.87,3.56 15.65,3.56 15.88,3.79 J6.71
  Bottom 0.178: v43.74,19.16 43.71,19.19 v43.71,21.67
  Bottom 0.203: v19.91,21.67 8.1,21.67 v8.05,21.72
RTS1-PROCESSOR  (via drill 0.3)
  Top 0.203: J1.13 63.65,16.59 v63.7,16.54 | J6.18 29.13,15.67 30,16.54 v56.92,16.54
  Bottom 0.203: v56.92,16.54 v63.7,16.54
RX1-DFU_TX-FC0-PLEX
  Top 0.203: J6.4 32.63,10.66 31.86,9.89 29.18,9.89 26.32,7.03 26.32,3.75 25.18,2.62 13.14,2.62 8.7,7.07 U1.P9
RX1-PROCESSOR  (via drill 0.3)
  Top 0.203: v62.16,13.4 v62.15,13.41 J1.19 | U1.P6 7.67,4.28 9.84,2.11 25.45,2.11 26.98,3.63 26.98,6.88 28.76,8.67 33.67,8.67 35.36,10.36 35.36,12.09 36.09,12.82 55.71,12.82 56.22,13.34 v56.32,13.34
  Bottom 0.203: v62.16,13.4 56.38,13.4 v56.32,13.34
RX1-PROCESSOR-PLEX  (via drill 0.3)
  Top 0.203: J6.13 30.38,1.78 29.06,0.46 6.27,0.46 5.46,1.27 5.46,6.04 v5.56,6.15 | U1.P7 8.25,6.26 8.47,6.05 v8.47,5.86
  Bottom 0.203: v8.47,5.86 8.18,6.15 v5.56,6.15
RX1/2S2  (via drill 0.3)
  Top 0.203: U1.P8 8.45,6.67 9.23,5.89 v9.23,5.82 | v4.28,12.7 J7.2
  Bottom 0.203: v9.23,5.82 9.88,5.82 10.54,6.48 10.54,12.32 10.16,12.7 v4.28,12.7
SHLD
  pour Bottom (isolate 0.305, no thermals): 71.63,67.31 80.26,67.31 80.26,72.69 71.63,72.69
  pour Top (isolate 0.305, no thermals): 71.63,67.31 80.52,67.31 80.52,72.69 71.63,72.69
SPI_PROCESSOR_SCK  (via drill 0.3)
  Top 0.203: J1.57 52.65,22.07 54.28,23.7 | 54.28,23.7 54.46,23.88 58.29,23.88 59.13,23.04 59.13,12.39 57.68,10.95 37.62,10.95 35.74,9.06 35.74,4.19 35.1,3.56 33.25,3.56 32.88,3.92 J6.3 | v52.96,25.02 53.59,25.65 58.67,25.65 59.69,26.67 59.69,40.84 60.76,41.91 64.77,41.91 65.81,42.95 65.81,52.65 63.11,55.36 J10.5 | v54.61,23.37 54.28,23.7
  Bottom 0.203: v52.96,25.02 v54.61,23.37
SPI_PROCESSOR_SDI
  Top 0.203: J1.61 51.65,21.8 51.6,21.85 51.6,22.43 54.3,25.13 59.17,25.13 59.56,25.53 | 59.56,25.53 60.1,26.06 60.1,30.73 60.53,31.17 60.53,40.21 60.96,40.64 65.26,40.64 66.53,41.91 66.53,55.02 65.31,56.24 J10.7 | 59.56,25.53 60.05,25.04 60.05,11.51 57.19,8.64 37.66,8.64 37.24,8.21 37.24,3.35 36.17,2.29 32.77,2.29 31.88,3.17 J6.7
SPI_PROCESSOR_SDO  (via drill 0.3)
  Top 0.203: J1.59 52.13,20.91 v52.13,22.1 52.13,22.25 54.51,24.63 58.88,24.63 59.55,23.96 59.55,11.71 57.78,9.94 37.33,9.94 36.55,9.16 36.55,3.79 35.66,2.9 32.99,2.9 32.38,3.51 J6.5 | v51.05,22.1 51.05,24.38 53.07,26.4 58.53,26.4 59.31,27.18 59.31,30.76 59.08,30.99 59.08,42.47 59.55,42.94 64.55,42.94 65.02,43.41 65.02,49.63 60.91,53.75 J10.3
  Bottom 0.203: v51.05,22.1 v52.13,22.1
SWDCK  (via drill 0.3)
  Top 0.203: J1.21 61.65,12.77 62.08,12.34 65.99,12.34 66.24,12.6 v67.46,12.6 | J5.4 84.45,13.96 84.94,14.45 84.94,16.87 84.28,17.53 80.95,17.53 80.06,16.64 80.06,13.01 79.74,12.69 v79.57,12.69
  Bottom 0.203: v67.46,12.6 79.48,12.6 v79.57,12.69
SWDIO  (via drill 0.3)
  Top 0.203: J1.23 61.15,12.25 61.72,11.68 v66.67,11.68 | v79.76,11.63 80.77,12.65 80.77,16.05 81.43,16.71 83.68,16.71 83.88,16.51 J5.2
  Bottom 0.203: v79.76,11.63 66.73,11.63 v66.67,11.68 | J5.2 83.88,15.93 83.87,15.94 83.87,17.76 TP1.1
TX1-DFU_RX-FC0-PLEX  (via drill 0.3)
  Top 0.203: J6.6 32.13,10.64 31.75,10.26 29.06,10.26 25.98,7.19 25.98,4.27 24.87,3.15 13.5,3.15 9.65,6.99 v9.64,6.99 | U1.P1 6.25,7.07 v5.99,7.32
  Bottom 0.203: v5.99,7.32 6.2,7.11 9.52,7.11 v9.64,6.99
TX1-PROCESSOR  (via drill 0.3)
  Top 0.203: v57.33,12.72 56.44,11.83 37.07,11.83 36.37,11.13 36.37,10.54 34.17,8.34 28.9,8.34 27.3,6.75 27.3,2.71 26.17,1.57 7.94,1.57 6.87,2.65 U1.P4 | J1.17 62.65,15.6 62.67,15.58 62.67,12.95 62.66,12.93 v62.66,12.85
  Bottom 0.203: v57.33,12.72 57.44,12.83 62.63,12.83 v62.66,12.85
TX1-PROCESSOR-PLEX
  Top 0.203: J6.15 29.87,5.13 29.87,2.65 28.29,1.07 6.91,1.07 6.04,1.93 6.04,5.91 6.4,6.26 U1.P3
TX1/1S2
  Top 0.203: J7.1 1.27,8.4 3,6.67 U1.P2
V_BATT  (via drill 0.3)
  Top 0.559: Q1.3 72.64,56.13 70.46,53.95 70.46,31.39 71.5,30.35 71.5,16 71.84,15.66 C4.1 | v73.53,6.35 72.66,7.22 J8.2 72.66,11.43 72.64,11.45 72.64,14.35 72.77,14.48 C4.1 | U2.3 74.17,15.66 C4.1
  Bottom 0.559: J12.2 80.14,6.35 v73.53,6.35 72.26,5.08 TP3.1
V_USB  (via drill 0.3)
  Top 0.203: 78.33,63.45 78.33,64.21 | U3.5 v74.91,63.25
  Top 0.254: J3.VBUS2 73.75,67.55 74.88,68.68 77.52,68.68 78.65,67.55 J3.VBUS1
  Top 0.559: F2.1 79.25,63.99 78.65,64.58 J3.VBUS1
  Bottom 0.203: v74.91,63.25 v79.32,63.25
  Bottom 0.559: BYP.1 80.19,62.92 79.98,63.12 79.45,63.12 v79.32,63.25
  pour Top (isolate 0.305, no thermals): 78.76,63.55 78.77,63.53 78.77,62.99 79.86,62.99 79.86,63.53 79.87,63.55 79.89,63.57 79.91,63.58 80.77,63.58 80.77,64.8 77.72,64.8 77.72,63.58 78.71,63.58 78.74,63.57
VCC  (via drill 0.3)
  Top 0.203: v52.58,50.29 R4.2
  Top 0.559: D5.C 74.05,55 72.01,52.96 v72.01,50.29 72.01,33.25 72.64,32.61 v72.64,18.8 | v48.64,50.29 48.9,50.29 | 48.9,50.29 v49.28,50.29 | U4.1 49.09,51.46 C2.1 48.93,50.33 48.9,50.29
  Bottom 0.559: v15.11,14.17 15.19,14.1 65.53,14.1 70.23,18.8 v72.64,18.8 | v48.64,50.29 v49.28,50.29 v52.58,50.29 v72.01,50.29
  other vias: 15.72,14.17
  pour Top (no thermals): 15.48,13.69 15.49,13.67 15.49,11.94 15.75,11.94 15.75,13.67 15.76,13.69 15.78,13.71 15.8,13.72 16,13.72 16,14.88 14.83,14.88 14.83,13.72 14.94,13.72 14.96,13.71 14.98,13.69 14.99,13.67 14.99,11.94 15.24,11.94 15.24,13.67 15.25,13.69 15.27,13.71 15.29,13.72 15.44,13.72 15.47,13.71
  pour Top (no thermals): 75.95,55.63 75.95,50.42 76.45,49.91 77.09,49.91 77.72,50.55 77.72,53.98 78.49,54.74 79.76,54.74 79.76,55.63
VCC_MEAS
  Top 0.203: C5.1 74.15,46.74 74.88,46.01 78.49,46.01 R9.2
  pour Top (no thermals): 73.66,51.69 73.28,51.31 73.28,45.47 73.79,44.96 74.04,44.96 74.04,45.59 74.93,46.48 74.93,51.18 74.42,51.69
VIN  (via drill 0.3)
  Top 0.203: R6.2 80.91,61.24 F2.2 | Q1.1 81.85,57.08 82.55,56.39 82.55,54.86 80.52,52.83 80.52,45.81 R8.2 | R5.1 80.43,35.85 v78.11,33.53
  Top 0.254: J1.9 64.65,19.29 65.28,18.67
  Top 0.559: 65.28,18.67 67.87,18.67 v69.01,19.81 v69.01,33.53 69.01,54.65 73.66,59.3 D5.A | D5.A 76.71,60.96 76.99,61.24 F2.2 | Q1.1 79.26,58.66 78.62,59.3 D5.A | R10.2 76.71,20.57 77.72,19.56 v77.72,18.29 | U2.4 77.47,15.56 | 77.47,15.56 77.98,15.56 | C3.1 78.77,15.56 78.11,15.56 77.98,15.56 | v77.72,16.38 77.72,15.81 | 77.72,15.81 77.47,15.56 | 77.72,15.81 77.98,15.56
  Bottom 0.203: v78.11,33.53 v69.01,33.53
  Bottom 0.559: v79.25,62.18 79.32,62.1 BYP.2 80.67,62.13 TP4.1 | v77.72,16.38 v77.72,18.29 76.03,19.98 69.18,19.98 v69.01,19.81
  pour Top (isolate 0.305, no thermals): 78.76,61.57 78.74,61.55 78.71,61.54 77.75,61.54 77.75,60.58 80.75,60.58 80.75,61.54 79.91,61.54 79.89,61.55 79.87,61.57 79.86,61.6 79.86,62.41 78.77,62.41 78.77,61.6
VIN/3  (via drill 0.3)
  Top 0.203: J1.49 54.65,21.84 54.96,22.15 v55.07,22.15 | R10.1 R7.2 74.17,22.64 74.17,22.86 v74.17,23.24
  Bottom 0.203: v55.07,22.15 73.08,22.15 v74.17,23.24

### Text on the board
Bottom: v21
tPlace: + | -
Measures: Units in Inches
tDocu: Elias Santistevan